# EAGLE design CDH-v3.7 (EAGLE 7.3.0)
sdf
DRAWING_AUTHOR: Lambert Le
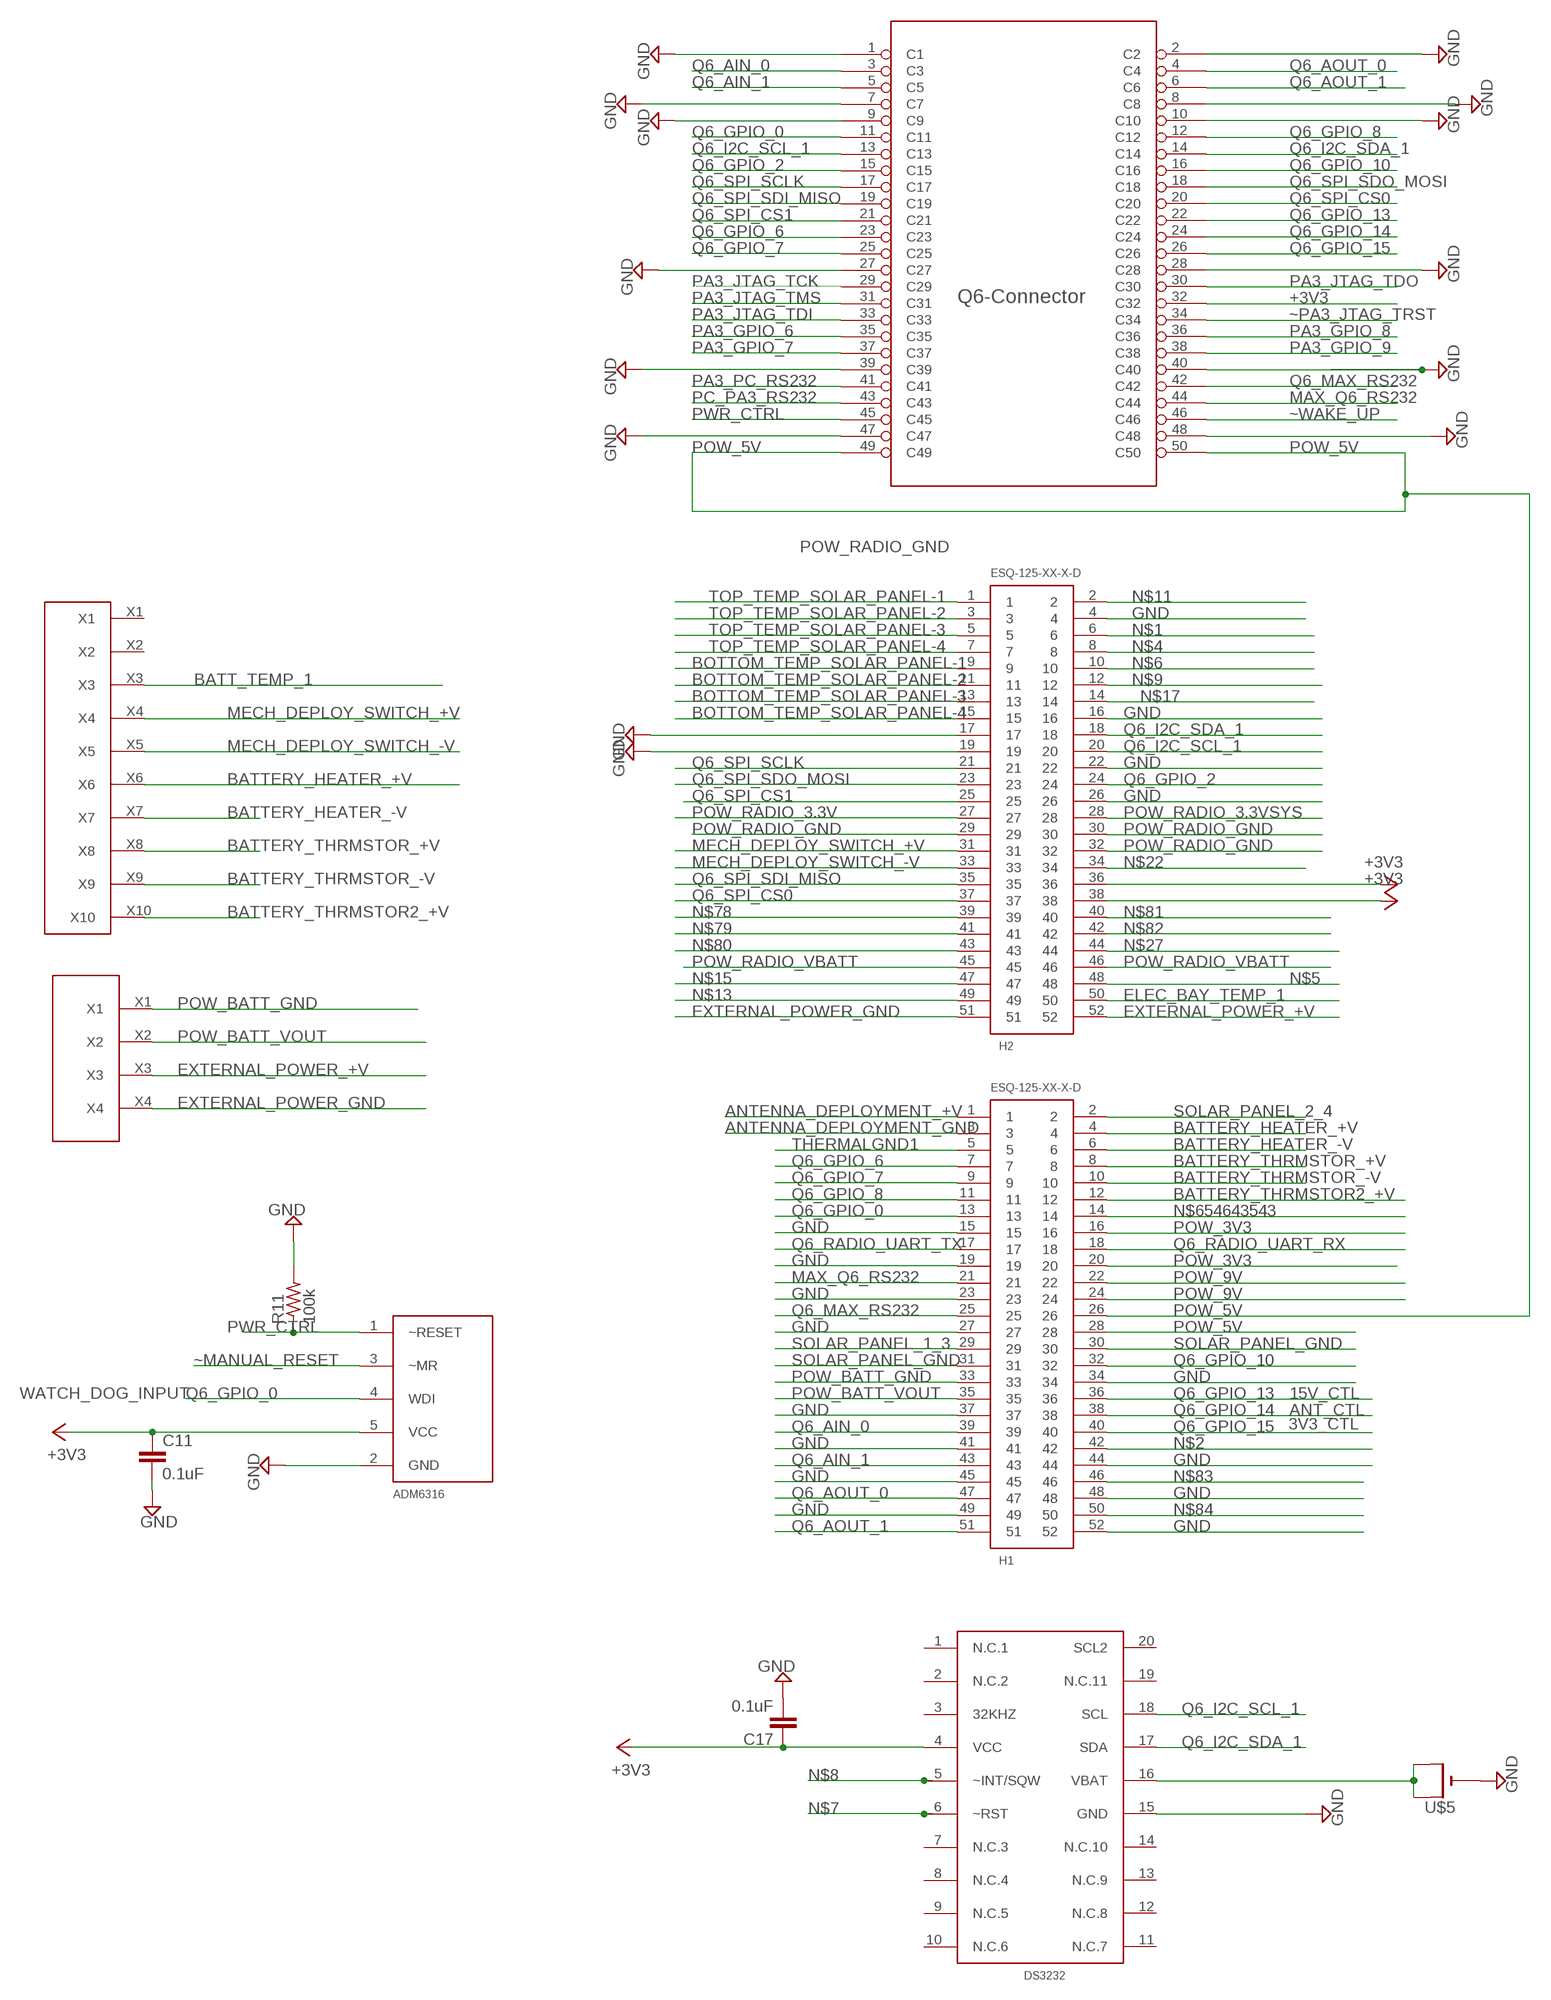
[diagram p0: schematic, sheet 1, part 1 of 2]
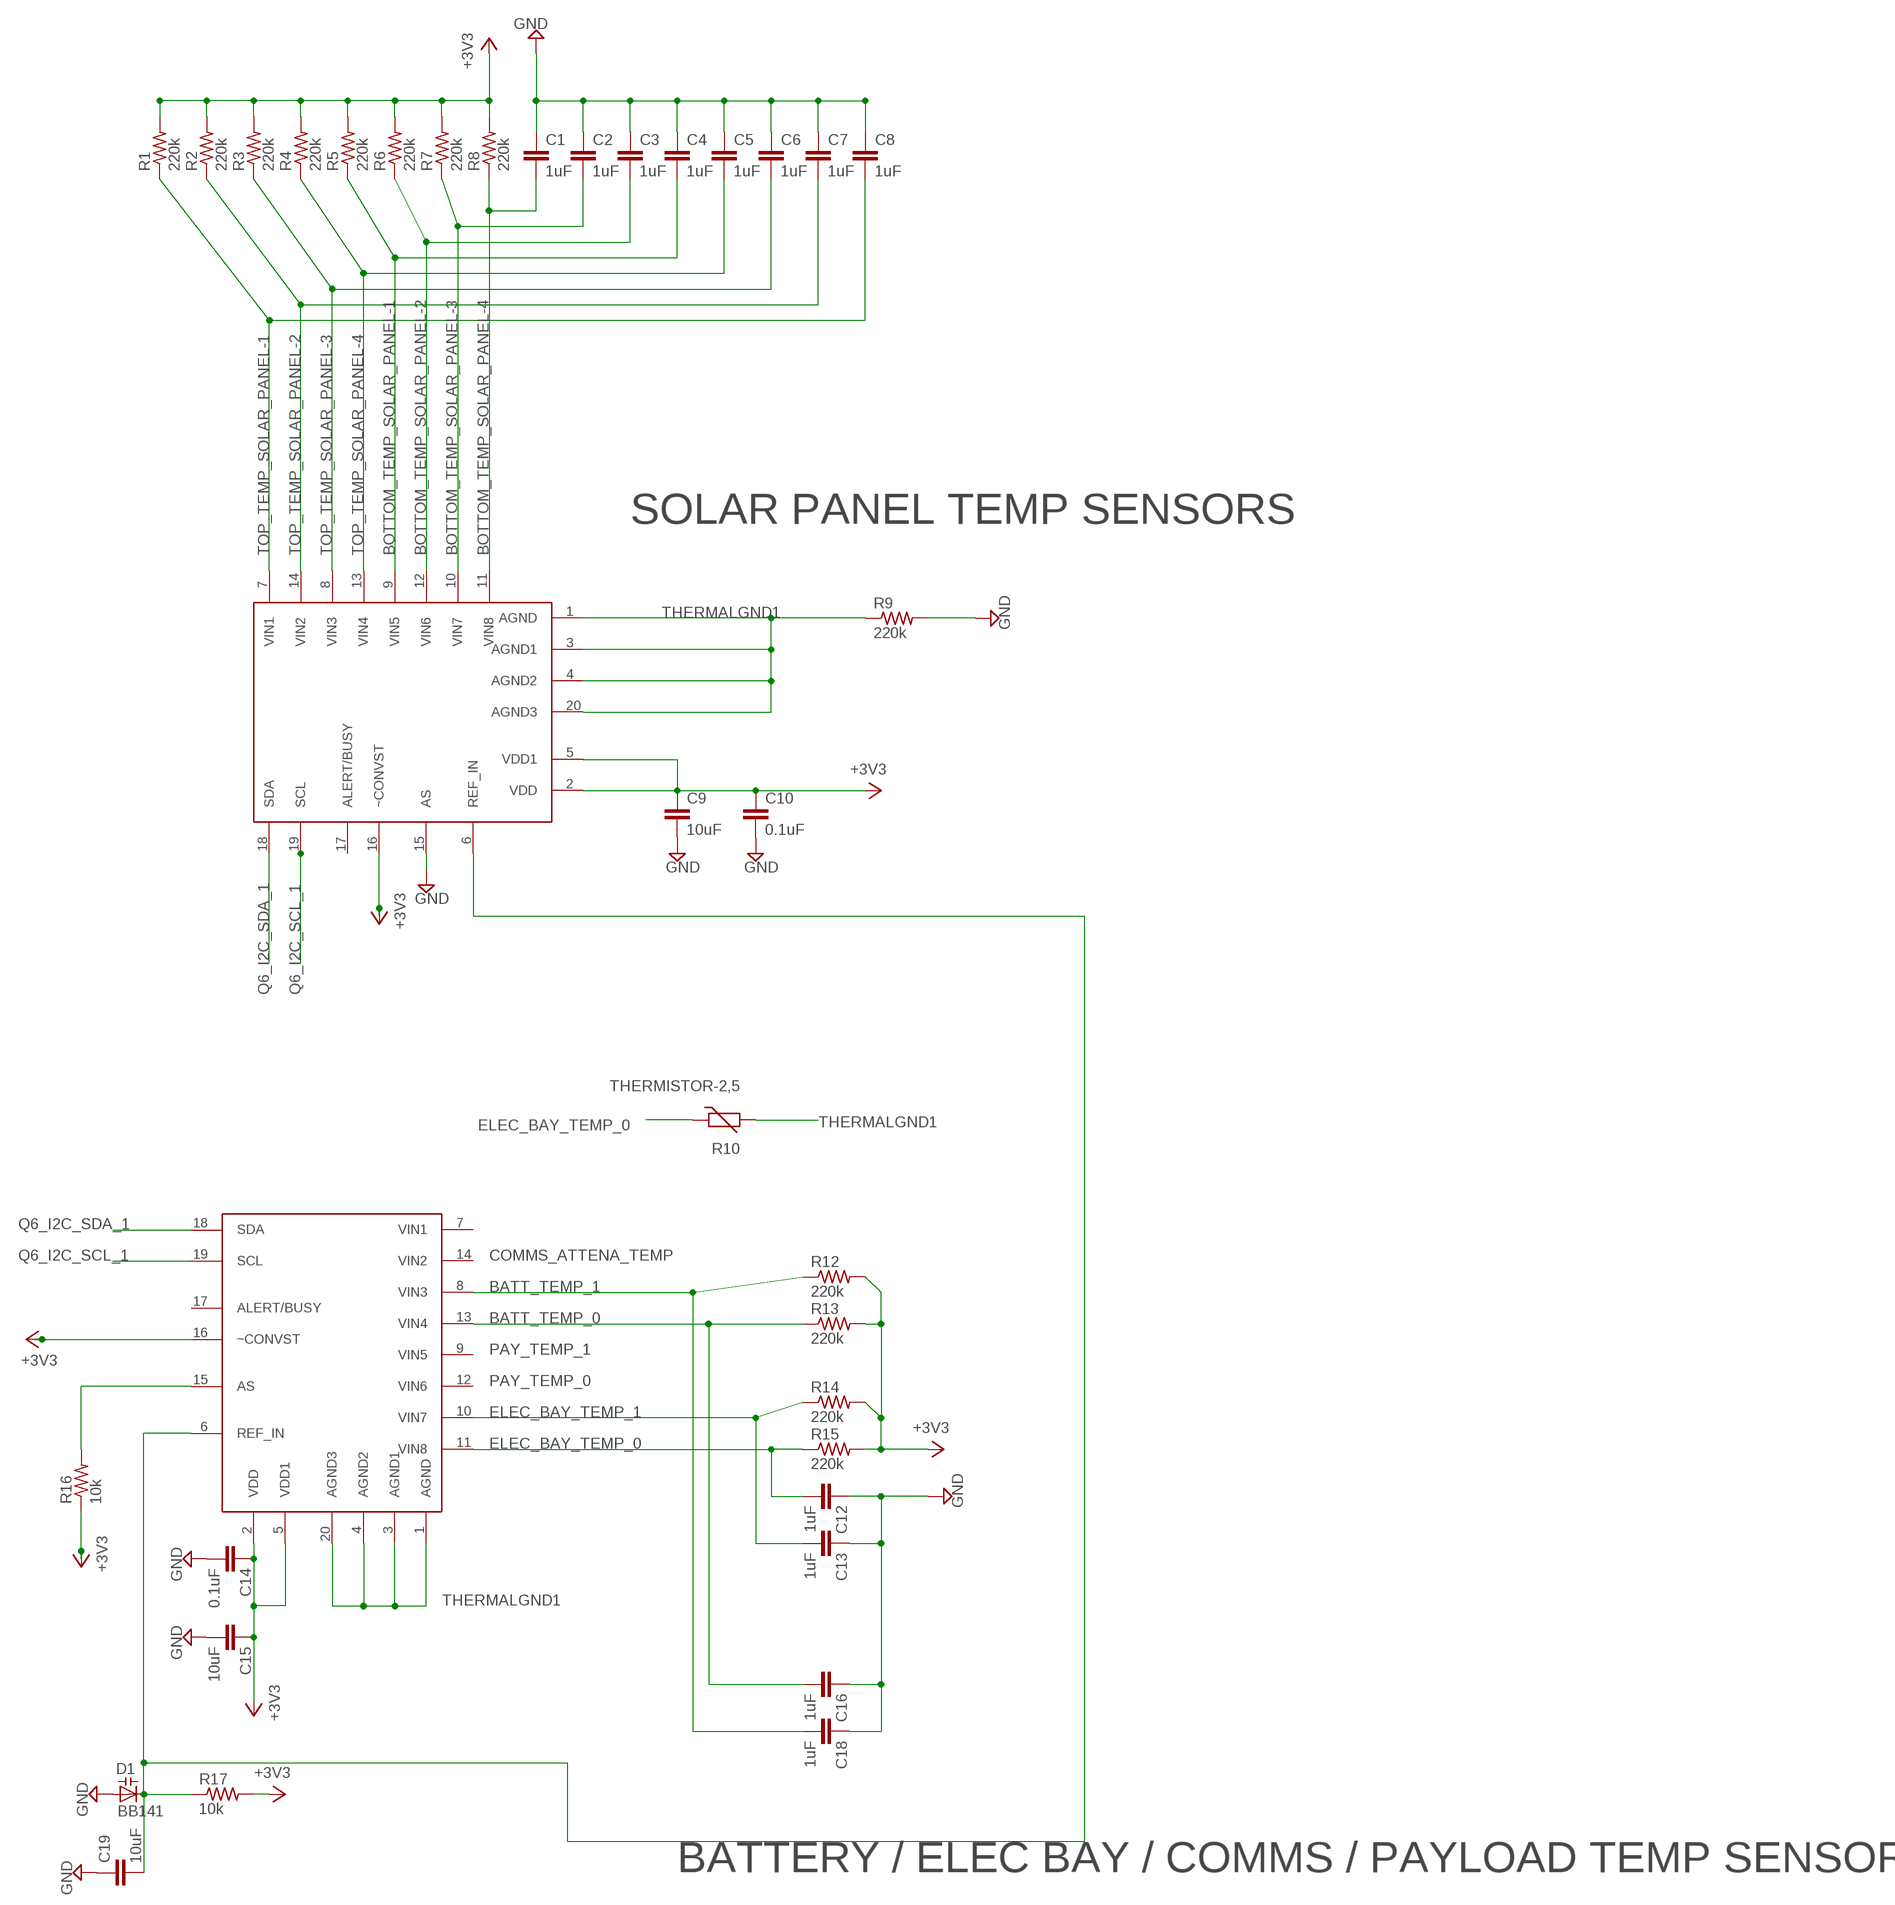
[diagram p1: schematic, sheet 1, part 2 of 2]

## Parts
ADC_TEMP_1  AD7998-1  [TSSOP20]
ADC_TEMP_2  AD7998-1  [TSSOP20]
C1  1uF  C-EUC2012  [C2012]
C2  1uF  C-EUC2012  [C2012]
C3  1uF  C-EUC2012  [C2012]
C4  1uF  C-EUC2012  [C2012]
C5  1uF  C-EUC2012  [C2012]
C6  1uF  C-EUC2012  [C2012]
C7  1uF  C-EUC2012  [C2012]
C8  1uF  C-EUC2012  [C2012]
C9  10uF  C-EUC2012  [C2012]
C10  0.1uF  C-EUC2012  [C2012]
C11  0.1uF  C-EUC2012  [C2012]
C12  1uF  C-EUC2012  [C2012]
C13  1uF  C-EUC2012  [C2012]
C14  0.1uF  C-EUC2012  [C2012]
C15  10uF  C-EUC2012  [C2012]
C16  1uF  C-EUC2012  [C2012]
C17  0.1uF  C-EUC2012  [C2012]
C18  1uF  C-EUC2012  [C2012]
C19  10uF  C-EUC2012  [C2012]
D1  BB141  [SOD523]
H1  ESQ-125-XX-X-D  [ESQ-125-XX-X-D]
H2  ESQ-125-XX-X-D  [ESQ-125-XX-X-D]
J2  M80-5000000M1-10-331-000  [M80-5000000M1]
J3  M80-5000000M1-10-331-00-000  [M80-5000000M1-04-331-00-000]
J4  SMFC  [SFMC-107-01-XX-D]
R1  220k  R-US_R2012  [R2012]
R2  220k  R-US_R2012  [R2012]
R3  220k  R-US_R2012  [R2012]
R4  220k  R-US_R2012  [R2012]
R5  220k  R-US_R2012  [R2012]
R6  220k  R-US_R2012  [R2012]
R7  220k  R-US_R2012  [R2012]
R8  220k  R-US_R2012  [R2012]
R9  220k  R-US_R2012  [R2012]
R10  THERMISTOR-2,5  [RS-2,5]
R11  100k  R-US_R2012  [R2012]
R12  220k  R-US_R2012  [R2012]
R13  220k  R-US_R2012  [R2012]
R14  220k  R-US_R2012  [R2012]
R15  220k  R-US_R2012  [R2012]
R16  10k  R-US_R2012  [R2012]
R17  10k  R-US_R2012  [R2012]
U$4  ADM6316/ADM6320  [SOT23-5]
U$5  CR1220SMT  [CR1220-SMD]
U$6  DS3232  [SO20L]

## Nets
+3V3: ADC_TEMP_1.2(VDD) ADC_TEMP_1.5(VDD1) ADC_TEMP_1.16(~CONVST) ADC_TEMP_2.2(VDD) ADC_TEMP_2.5(VDD1) ADC_TEMP_2.16(~CONVST) C9.1 C10.1 C11.1 C14.1 C15.1 C17.1 H2.36 H2.38 J4.32(C32) R1.2 R2.2 R3.2 R4.2 R5.2 R6.2 R7.2 R8.2 R12.2 R13.2 R14.2 R15.2 R16.1 R17.2 U$4.5(VCC) U$6.4(VCC)
ANTENNA_DEPLOYMENT_+V: H1.1
ANTENNA_DEPLOYMENT_GND: H1.3
BATT_TEMP_0: ADC_TEMP_2.13(VIN4) C16.2 R13.1
BATT_TEMP_1: ADC_TEMP_2.8(VIN3) C18.2 J2.X3 R12.1
BATTERY_HEATER_+V: H1.4 J2.X6
BATTERY_HEATER_-V: H1.6 J2.X7
BATTERY_THRMSTOR2_+V: H1.12 J2.X10
BATTERY_THRMSTOR_+V: H1.8 J2.X8
BATTERY_THRMSTOR_-V: H1.10 J2.X9
BOTTOM_TEMP_SOLAR_PANEL-1: ADC_TEMP_1.9(VIN5) C4.2 H2.9 R5.1
BOTTOM_TEMP_SOLAR_PANEL-2: ADC_TEMP_1.12(VIN6) C3.2 H2.11 R6.1
BOTTOM_TEMP_SOLAR_PANEL-3: ADC_TEMP_1.10(VIN7) C2.2 H2.13 R7.1
BOTTOM_TEMP_SOLAR_PANEL-4: ADC_TEMP_1.11(VIN8) C1.2 H2.15 R8.1
ELEC_BAY_TEMP_0: ADC_TEMP_2.11(VIN8) C12.2 R10.1 R15.1
ELEC_BAY_TEMP_1: ADC_TEMP_2.10(VIN7) C13.2 H2.50 R14.1
EXTERNAL_POWER_+V: H2.52 J3.X3
EXTERNAL_POWER_GND: H2.51 J3.X4
GND: ADC_TEMP_1.15(AS) C1.1 C2.1 C3.1 C4.1 C5.1 C6.1 C7.1 C8.1 C9.2 C10.2 C11.2 C12.1 C13.1 C14.2 C15.2 C16.1 C17.2 C18.1 C19.1 D1.A H1.15 H1.19 H1.23 H1.27 H1.34 H1.37 H1.41 H1.44 H1.45 H1.48 H1.49 H1.52 H2.4 H2.16 H2.17 H2.19 H2.22 H2.26 J4.1(C1) J4.2(C2) J4.7(C7) J4.8(C8) J4.9(C9) J4.10(C10) J4.27(C27) J4.28(C28) J4.39(C39) J4.40(C40) J4.47(C47) J4.48(C48) R9.2 R11.2 U$4.2(GND) U$5.- U$6.15(GND)
MAX_Q6_RS232: H1.21 J4.44(C44)
MECH_DEPLOY_SWITCH_+V: H2.31 J2.X4
MECH_DEPLOY_SWITCH_-V: H2.33 J2.X5
N$1: H2.6
N$2: H1.42
N$3: ADC_TEMP_2.15(AS) R16.2
N$4: H2.8
N$5: H2.48
N$6: H2.10
N$7: U$6.6(~RST)
N$8: U$6.5(~INT/SQW)
N$9: H2.12
N$11: H2.2
N$13: H2.49
N$15: H2.47
N$17: H2.14
N$22: H2.34
N$27: H2.44
N$78: H2.39
N$79: H2.41
N$80: H2.43
N$81: H2.40
N$82: H2.42
N$83: H1.46
N$84: H1.50
N$654643543: H1.14
PA3_GPIO_6: J4.35(C35)
PA3_GPIO_7: J4.37(C37)
PA3_GPIO_8: J4.36(C36)
PA3_GPIO_9: J4.38(C38)
PA3_JTAG_TCK: J4.29(C29)
PA3_JTAG_TDI: J4.33(C33)
PA3_JTAG_TDO: J4.30(C30)
PA3_JTAG_TMS: J4.31(C31)
PA3_PC_RS232: J4.41(C41)
PC_PA3_RS232: J4.43(C43)
POW_3V3: H1.16 H1.20
POW_5V: H1.26 H1.28 J4.49(C49) J4.50(C50)
POW_9V: H1.22 H1.24
POW_BATT_GND: H1.33 J3.X1
POW_BATT_VOUT: H1.35 J3.X2
POW_RADIO_3.3V: H2.27
POW_RADIO_3.3VSYS: H2.28
POW_RADIO_GND: H2.29 H2.30 H2.32
POW_RADIO_VBATT: H2.45 H2.46
PWR_CTRL: J4.45(C45) R11.1 U$4.1(~RESET)
Q6_AIN_0: H1.39 J4.3(C3)
Q6_AIN_1: H1.43 J4.5(C5)
Q6_AOUT_0: H1.47 J4.4(C4)
Q6_AOUT_1: H1.51 J4.6(C6)
Q6_GPIO_0: H1.13 J4.11(C11) U$4.4(WDI)
Q6_GPIO_2: H2.24 J4.15(C15)
Q6_GPIO_6: H1.7 J4.23(C23)
Q6_GPIO_7: H1.9 J4.25(C25)
Q6_GPIO_8: H1.11 J4.12(C12)
Q6_GPIO_10: H1.32 J4.16(C16)
Q6_GPIO_13: H1.36 J4.22(C22)
Q6_GPIO_14: H1.38 J4.24(C24)
Q6_GPIO_15: H1.40 J4.26(C26)
Q6_I2C_SCL_1: ADC_TEMP_1.19(SCL) ADC_TEMP_2.19(SCL) H2.20 J4.13(C13) U$6.18(SCL)
Q6_I2C_SDA_1: ADC_TEMP_1.18(SDA) ADC_TEMP_2.18(SDA) H2.18 J4.14(C14) U$6.17(SDA)
Q6_MAX_RS232: H1.25 J4.42(C42)
Q6_RADIO_UART_RX: H1.18
Q6_RADIO_UART_TX: H1.17
Q6_SPI_CS0: H2.37 J4.20(C20)
Q6_SPI_CS1: H2.25 J4.21(C21)
Q6_SPI_SCLK: H2.21 J4.17(C17)
Q6_SPI_SDI_MISO: H2.35 J4.19(C19)
Q6_SPI_SDO_MOSI: H2.23 J4.18(C18)
REF_IN: ADC_TEMP_1.6(REF_IN) ADC_TEMP_2.6(REF_IN) C19.2 D1.C R17.1
SOLAR_PANEL_1_3: H1.29
SOLAR_PANEL_2_4: H1.2
SOLAR_PANEL_GND: H1.30 H1.31
THERMALGND1: ADC_TEMP_1.1(AGND) ADC_TEMP_1.3(AGND1) ADC_TEMP_1.4(AGND2) ADC_TEMP_1.20(AGND3) ADC_TEMP_2.1(AGND) ADC_TEMP_2.3(AGND1) ADC_TEMP_2.4(AGND2) ADC_TEMP_2.20(AGND3) H1.5 R9.1 R10.2
TOP_TEMP_SOLAR_PANEL-1: ADC_TEMP_1.7(VIN1) C8.2 H2.1 R1.1
TOP_TEMP_SOLAR_PANEL-2: ADC_TEMP_1.14(VIN2) C7.2 H2.3 R2.1
TOP_TEMP_SOLAR_PANEL-3: ADC_TEMP_1.8(VIN3) C6.2 H2.5 R3.1
TOP_TEMP_SOLAR_PANEL-4: ADC_TEMP_1.13(VIN4) C5.2 H2.7 R4.1
VBAT: U$5.+$1(+) U$5.+$2(+1) U$6.16(VBAT)
~MANUAL_RESET: U$4.3(~MR)
~PA3_JTAG_TRST: J4.34(C34)
~WAKE_UP: J4.46(C46)
Unconnected: ADC_TEMP_1.17(ALERT/BUSY) ADC_TEMP_2.7(VIN1) ADC_TEMP_2.9(VIN5) ADC_TEMP_2.12(VIN6) ADC_TEMP_2.14(VIN2) ADC_TEMP_2.17(ALERT/BUSY) J2.X1 J2.X2 U$6.1(N.C.1) U$6.2(N.C.2) U$6.3(32KHZ) U$6.7(N.C.3) U$6.8(N.C.4) U$6.9(N.C.5) U$6.10(N.C.6) U$6.11(N.C.7) U$6.12(N.C.8) U$6.13(N.C.9) U$6.14(N.C.10) U$6.19(N.C.11) U$6.20(SCL2)

## Notes on the sheet
- Q6_AOUT_0
- Q6_AOUT_1
- Q6-Connector
- SOLAR PANEL TEMP SENSORS
- POW_RADIO_GND
- SOLAR_PANEL_2_4
- COMMS_ATTENA_TEMP
- BATT_TEMP_1
- BATT_TEMP_0
- PAY_TEMP_1
- WATCH_DOG_INPUT | 15V_CTL | PAY_TEMP_0
- ANT_CTL
- 3V3_CTL | ELEC_BAY_TEMP_1
- ELEC_BAY_TEMP_0
- BATTERY / ELEC BAY / COMMS / PAYLOAD TEMP SENSORS

## Library data of the parts
ADC_TEMP_1 ADC_TEMP_2 = analog-devices:AD7998-1
C1-C19 = rcl:C-EU: CAPACITOR, European symbol
D1 = diode:BB141: Capacity DIODE variable-capacitance diode
H1 H2 = ESQ-126-XX-X-D:ESQ-125-XX-X-D: ELEVATED SOCKET, .100 inch(2.54mm) PITCH
J2 = harwin:M80-5000000M1-10-331-000
J3 = harwin:M80-5000000M1-10-331-00-000
J4 = SFMC-125-02-S-D:SMFC
R1-R9 R11-R17 = resistor:R-US_: RESISTOR, American symbol
R10 = varistor:THERMISTOR: THERMISTOR
U$4 = analog-devices:ADM6316/ADM6320
U$5 = adafruit:CR1220: CR1216/CR1220/CR1225 12mm 3V lithium coin cell Great for battery packup. Both SMT and THM holders. Note the THM package has the ground pads on both sides of the PCB so that the masks are the same - this reduces the cost
U$6 = maxim:DS3232

## Net classes
0 default: width 0.406 mm

## Board
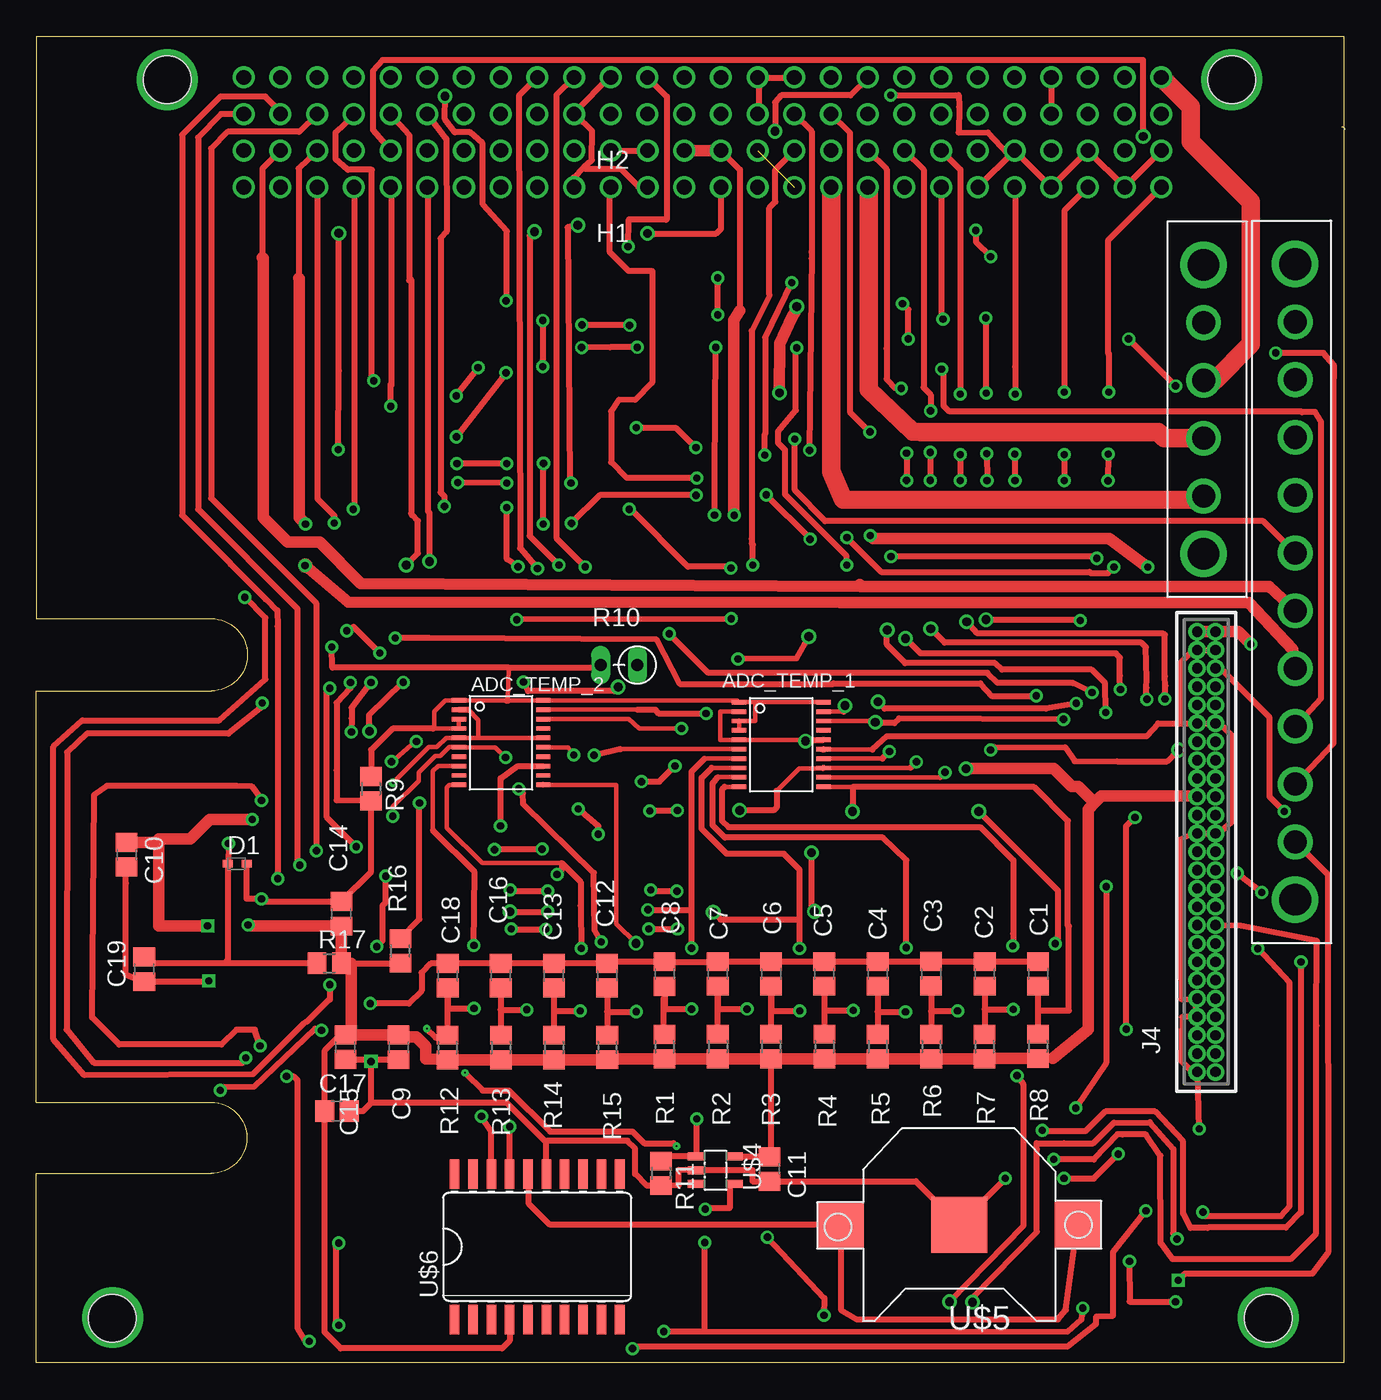
[diagram p2: board, top side]
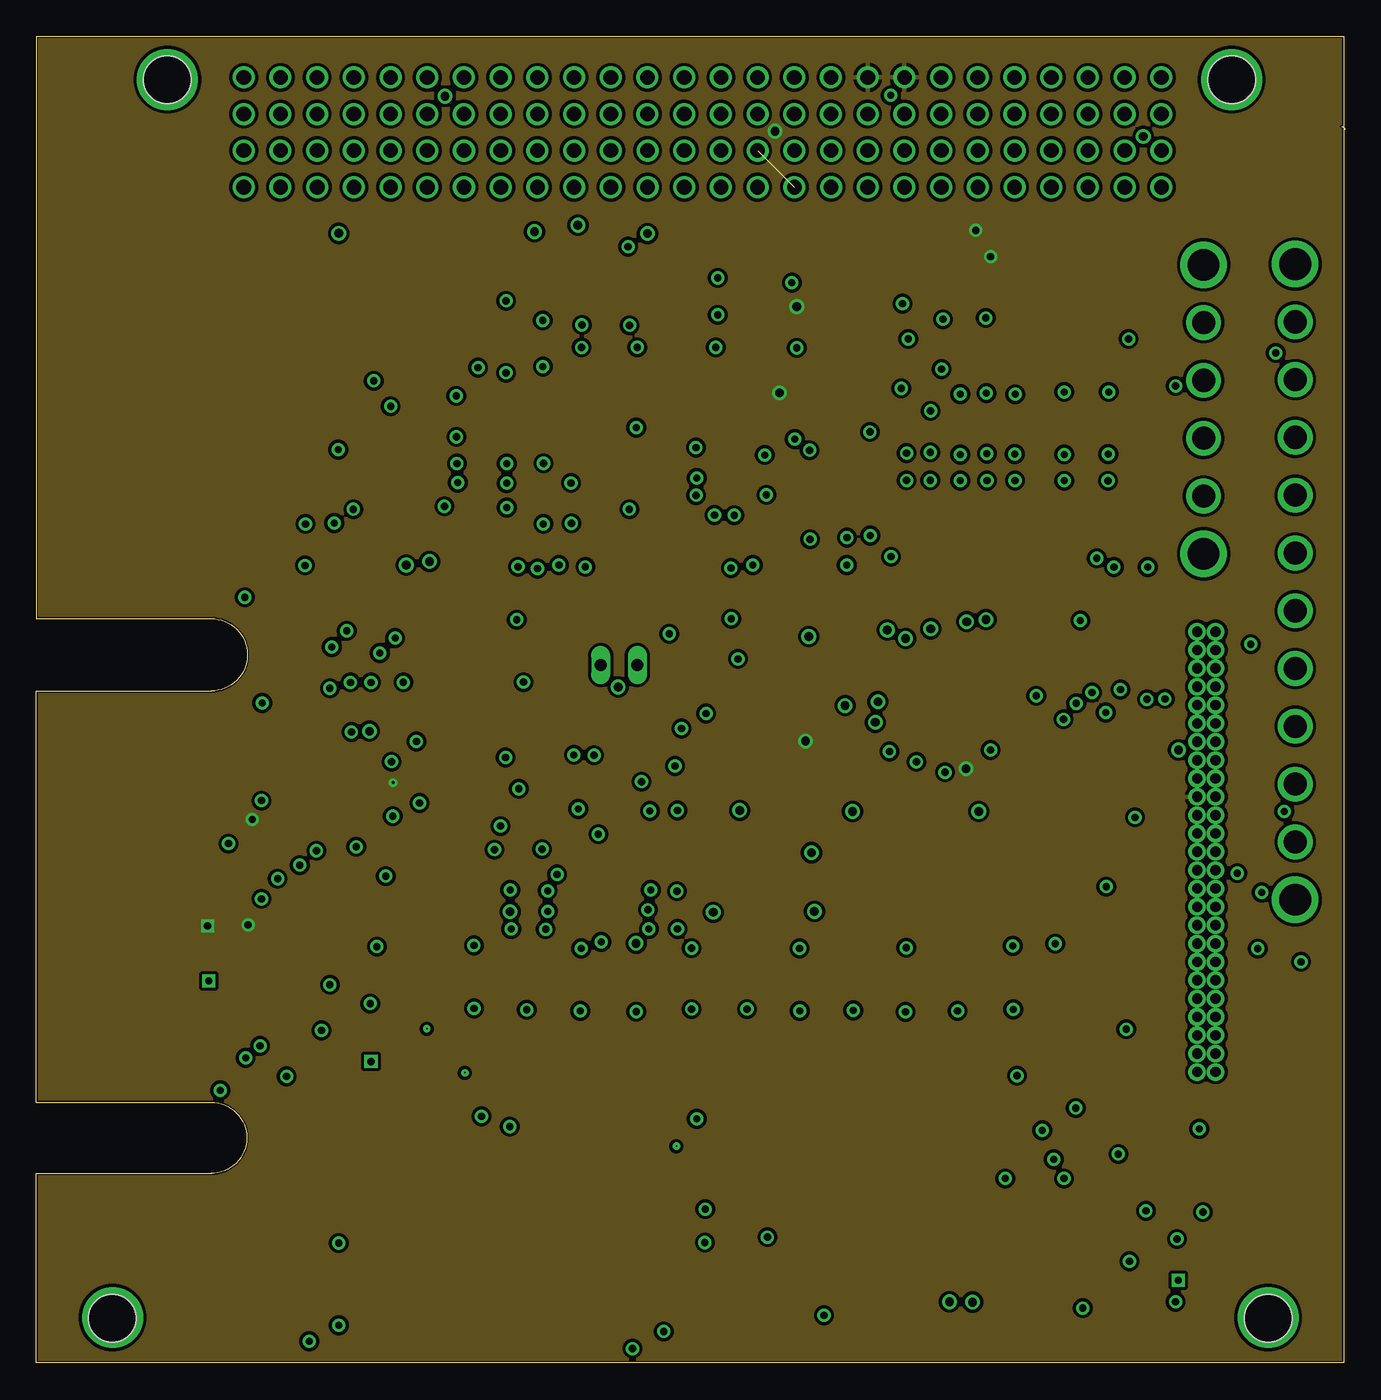
[diagram p3: board, inner layer +3V3]
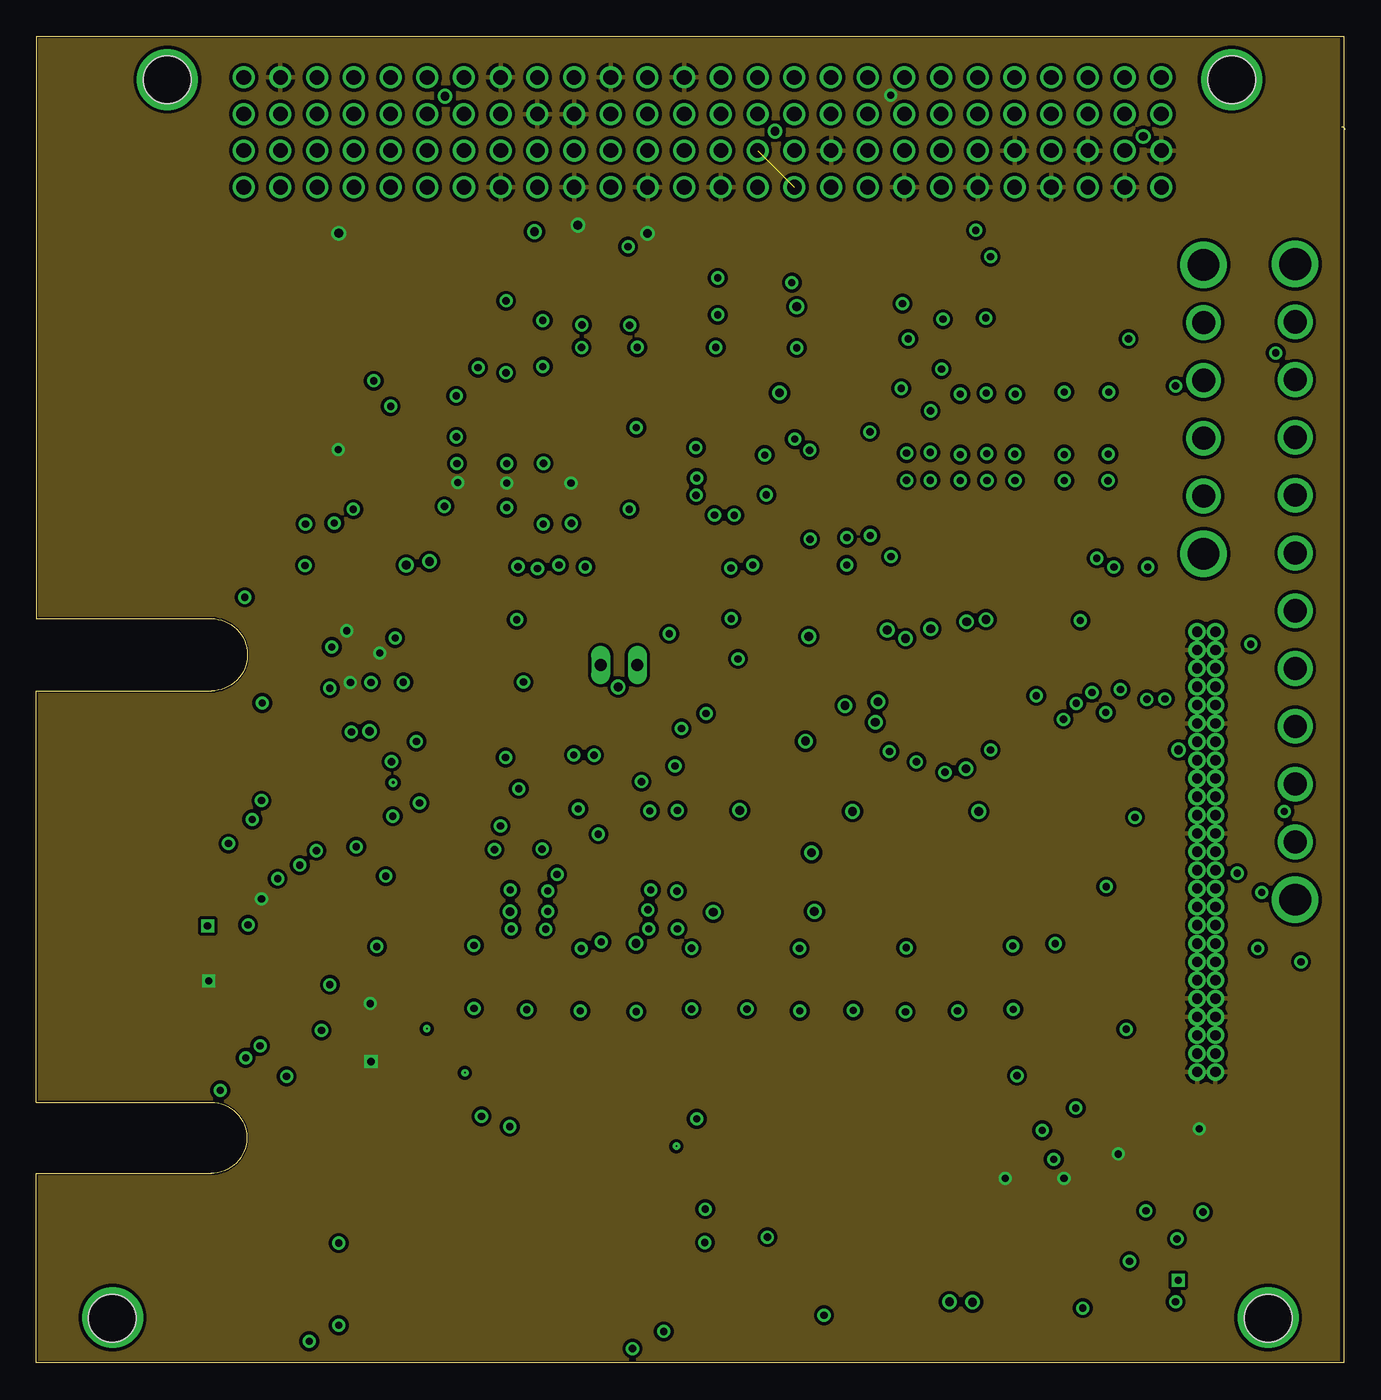
[diagram p4: board, inner layer GND]
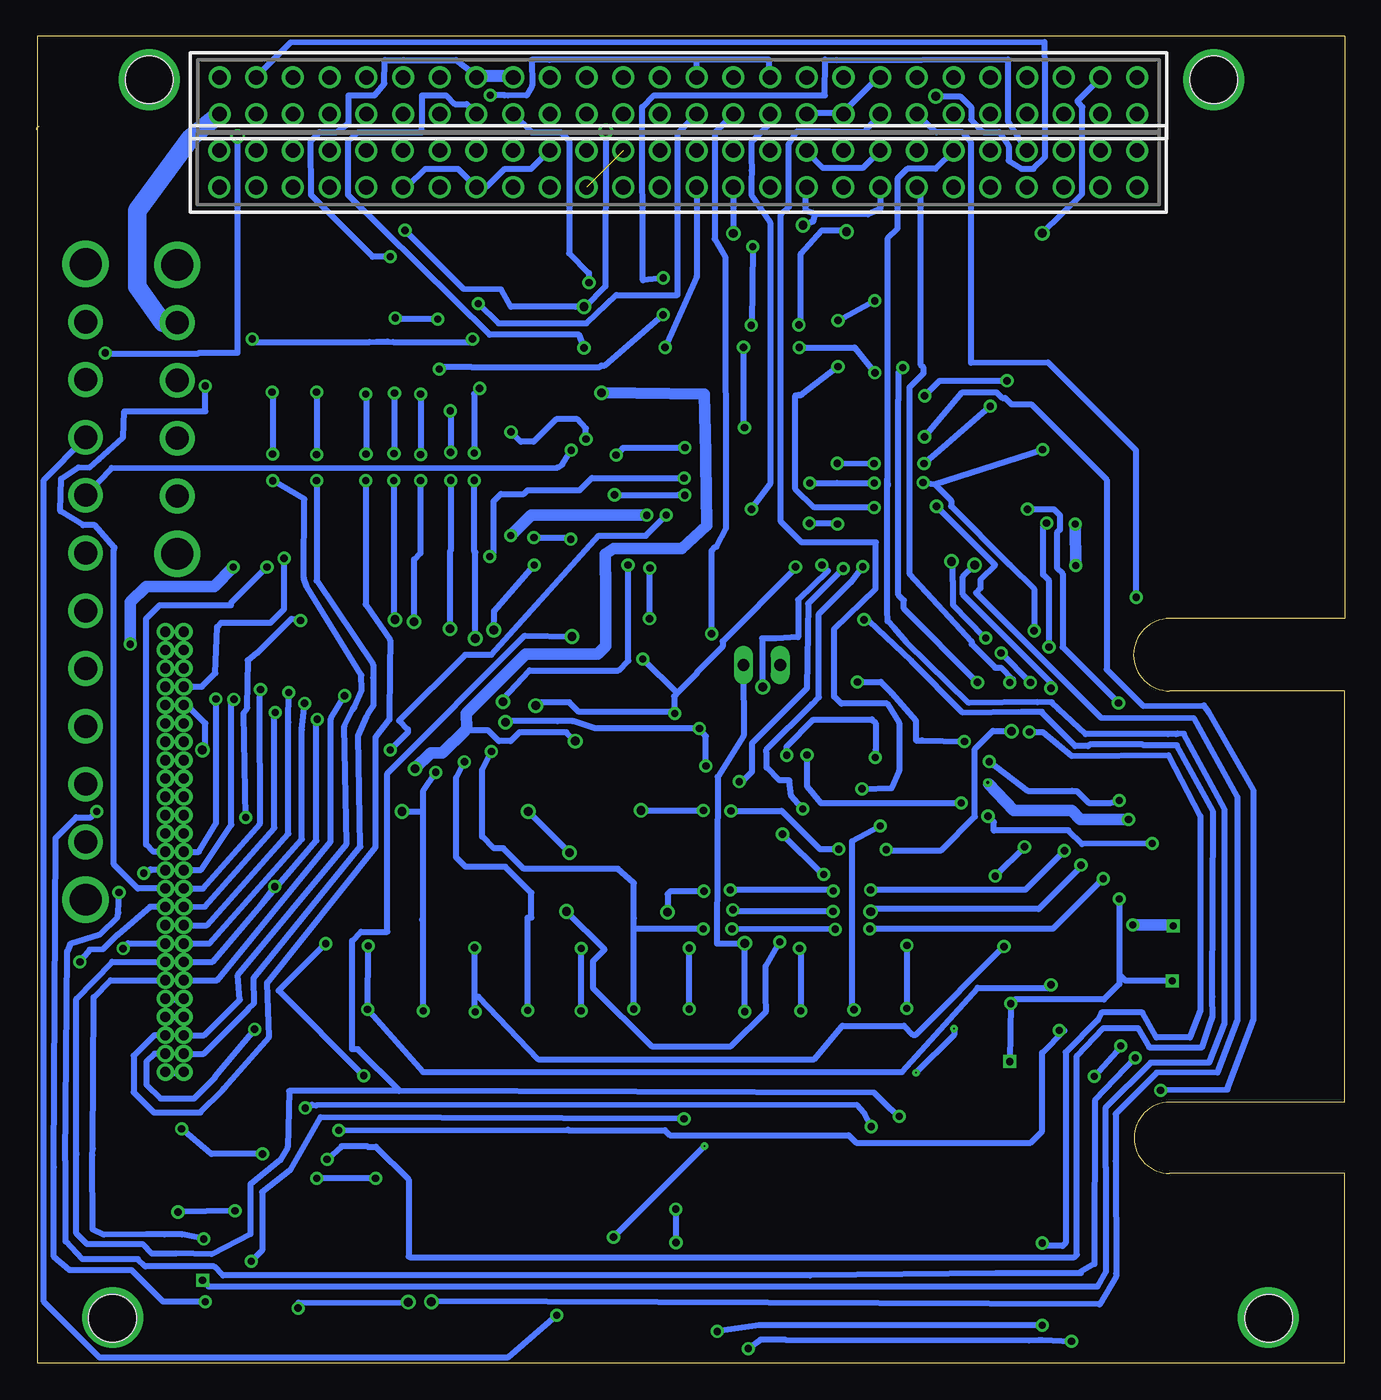
[diagram p5: board, bottom side, seen from below]

Size 90.56 x 91.83 mm. Coordinates in mm from the lower left corner, seen from the top.
Outline: 0.01,51.5 12.13,51.5
Outline: 12.14,46.5 0.01,46.5 0,18.03 12.13,18.03
Outline: 12.14,13.09 0.01,13.09 0.01,0 90.48,0 90.48,91.83 0.01,91.83 0.01,51.5
Outline: 12.12,51.5 arc-180 12.11,46.49
Outline: 12.11,18.03 arc-180 12.09,13.09
Outline: 90.34,85.56 arc-90 90.56,85.35
Copper layers (1*2+15*16): Top 0.035mm / dielectric 0.5mm / +3V3 0.035mm / dielectric 0.5mm / GND 0.035mm / dielectric 0.5mm / Bottom 0.035mm
Design rules "default": minimum track width 4mil, minimum drill 4mil, track to track 9mil, track to pad 9mil, pad to pad 9mil, via to via 9mil, smd to smd 9mil, copper to edge 5mil, drill to drill 5mil, minimum pad ring 10mil, minimum via ring 8mil, stop-mask expansion 4mil, vias tented up to drill 0mil, thermal gap 10mil
Holes 3.3 mm at 5.27,3.07 9.08,88.79 85.28,3.07 82.74,88.79

### Footprints (pad centres in the part's own frame; a part is rotated, then mirrored left to right if it is on the bottom)
TSSOP20 = smd 0.305 x 0.991: 1 -3.575,-2.918; 2 -2.925,-2.918; 3 -2.275,-2.918; 4 -1.625,-2.918; 5 -0.975,-2.918; 6 -0.325,-2.918; 7 0.325,-2.918; 8 0.975,-2.918; 9 1.625,-2.918; 10 2.275,-2.918; 11 2.275,2.918; 12 1.625,2.918; 13 0.975,2.918; 14 0.325,2.918; 15 -0.325,2.918; 16 -0.975,2.918; 17 -1.625,2.918; 18 -2.275,2.918; 19 -2.925,2.918; 20 -3.575,2.918
C2012 = smd 1.3 x 1.5: 1 -0.85,0; 2 0.85,0
SOD523 = smd 0.7 x 0.5: A 0.7,0; C -0.6,0
ESQ-125-XX-X-D = drill 1.016 pad 1.524: 1 -27.94,-1.27; 2 -27.94,1.27; 3 -25.4,-1.27; 4 -25.4,1.27; 5 -22.86,-1.27; 6 -22.86,1.27; 7 -20.32,-1.27; 8 -20.32,1.27; 9 -17.78,-1.27; 10 -17.78,1.27; 11 -15.24,-1.27; 12 -15.24,1.27; 13 -12.7,-1.27; 14 -12.7,1.27; 15 -10.16,-1.27; 16 -10.16,1.27; 17 -7.62,-1.27; 18 -7.62,1.27; 19 -5.08,-1.27; 20 -5.08,1.27; 21 -2.54,-1.27; 22 -2.54,1.27; 23 0,-1.27; 24 0,1.27; 25 2.54,-1.27; 26 2.54,1.27; 27 5.08,-1.27; 28 5.08,1.27; 29 7.62,-1.27; 30 7.62,1.27; 31 10.16,-1.27; 32 10.16,1.27; 33 12.7,-1.27; 34 12.7,1.27; 35 15.24,-1.27; 36 15.24,1.27; 37 17.78,-1.27; 38 17.78,1.27; 39 20.32,-1.27; 40 20.32,1.27; 41 22.86,-1.27; 42 22.86,1.27; 43 25.4,-1.27; 44 25.4,1.27; 45 27.94,-1.27; 46 27.94,1.27; 47 30.48,-1.27; 48 30.48,1.27; 49 33.02,-1.27; 50 33.02,1.27; 51 35.56,-1.27; 52 35.56,1.27
M80-5000000M1 = drill 2.2: P$11 -22,0; P$12 22,0 | drill 1.6: X1 -18,0; X2 -14,0; X3 -10,0; X4 -6,0; X5 -2,0; X6 2,0; X7 6,0; X8 10,0; X9 14,0; X10 18,0
M80-5000000M1-04-331-00-000 = drill 2.2: P$11 -10,0; P$12 10,0 | drill 1.6: X1 -6,0; X2 -2,0; X3 2,0; X4 6,0
SFMC-107-01-XX-D = drill 0.711 pad 1.067: 1 -15.875,-0.635; 2 -15.875,0.635; 3 -14.605,-0.635; 4 -14.605,0.635; 5 -13.335,-0.635; 6 -13.335,0.635; 7 -12.065,-0.635; 8 -12.065,0.635; 9 -10.795,-0.635; 10 -10.795,0.635; 11 -9.525,-0.635; 12 -9.525,0.635; 13 -8.255,-0.635; 14 -8.255,0.635; 15 -6.985,-0.635; 16 -6.985,0.635; 17 -5.715,-0.635; 18 -5.715,0.635; 19 -4.445,-0.635; 20 -4.445,0.635; 21 -3.175,-0.635; 22 -3.175,0.635; 23 -1.905,-0.635; 24 -1.905,0.635; 25 -0.635,-0.635; 26 -0.635,0.635; 27 0.635,-0.635; 28 0.635,0.635; 29 1.905,-0.635; 30 1.905,0.635; 31 3.175,-0.635; 32 3.175,0.635; 33 4.445,-0.635; 34 4.445,0.635; 35 5.715,-0.635; 36 5.715,0.635; 37 6.985,-0.635; 38 6.985,0.635; 39 8.255,-0.635; 40 8.255,0.635; 41 9.525,-0.635; 42 9.525,0.635; 43 10.795,-0.635; 44 10.795,0.635; 45 12.065,-0.635; 46 12.065,0.635; 47 13.335,-0.635; 48 13.335,0.635; 49 14.605,-0.635; 50 14.605,0.635
R2012 = smd 1.3 x 1.5: 1 -0.85,0; 2 0.85,0
RS-2,5 = drill 0.813 long: 1 -1.27,0; 2 1.27,0
SOT23-5 = smd 0.55 x 1.2: 1 -0.95,-1.3; 2 0,-1.3; 3 0.95,-1.3; 4 0.95,1.3; 5 -0.95,1.3
CR1220-SMD = smd 3.2 x 3.2: +$1 -8.2,0; +$2 8.2,0 | smd 3.9 x 3.9: - 0,0
SO20L = smd 0.66 x 2.032: 1 -5.715,-5.029; 2 -4.445,-5.029; 3 -3.175,-5.029; 4 -1.905,-5.029; 5 -0.635,-5.029; 6 0.635,-5.029; 7 1.905,-5.029; 8 3.175,-5.029; 9 4.445,-5.029; 10 5.715,-5.029; 11 5.715,5.029; 12 4.445,5.029; 13 3.175,5.029; 14 1.905,5.029; 15 0.635,5.029; 16 -0.635,5.029; 17 -1.905,5.029; 18 -3.175,5.029; 19 -4.445,5.029; 20 -5.715,5.029

### Placement (x,y rotation side)
ADC_TEMP_1  51.57,42.14 270 top
ADC_TEMP_2  32.17,42.27 270 top
C1  69.34,26.9 270 top
C2  65.65,26.91 270 top
C3  61.93,26.92 270 top
C4  58.24,26.91 270 top
C5  54.55,26.91 270 top
C6  50.86,26.9 270 top
C7  47.17,26.91 270 top
C8  43.49,26.9 270 top
C9  25.08,21.83 270 top
C10  6.26,35.16 270 top
C11  50.75,13.4 270 top
C12  39.51,26.79 270 top
C13  35.83,26.78 270 top
C14  21.12,31.07 90 top
C15  21.4,21.83 270 top
C16  32.15,26.79 270 top
C17  20.82,17.41 0 top
C18  28.48,26.78 270 top
C19  7.48,27.22 90 top
D1  13.86,34.53 0 top
H1  42.31,82.64 0 top
H2  42.3,87.7 0 top
J2  87.13,54.05 270 top
J3  80.79,65.99 90 top
J4  80.98,35.99 90 top
R1  43.48,21.88 270 top
R2  47.17,21.88 270 top
R3  50.85,21.88 270 top
R4  54.55,21.88 270 top
R5  58.24,21.88 270 top
R6  61.94,21.87 270 top
R7  65.63,21.87 270 top
R8  69.33,21.89 270 top
R9  23.17,39.72 270 top
R10  40.34,48.29 180 top
R11  43.24,13.1 270 top
R12  28.47,21.81 270 top
R13  32.16,21.81 270 top
R14  35.84,21.81 270 top
R15  39.52,21.82 270 top
R16  25.21,28.5 90 top
R17  20.28,27.64 0 top
U$4  47.01,13.32 270 top
U$5  63.88,9.54 180 top
U$6  34.67,8.02 0 top

### Tracks (layer width: path | path; a pad name or v marks a point on that pad's centre or on a via)
+3V3  (via drill 0.2, 0.5, 0.6, 0.61)
  Top 0.305: 30.61,43.24 ADC_TEMP_2.5 28.38,43.24 27.74,42.6 27.15,42.6 v24.7,40.15 | 30.61,43.24 ADC_TEMP_2.16 | 29.9,45.19 30.61,44.49 30.61,43.24 | 53.25,43.11 ADC_TEMP_1.5 47.33,43.11 47.33,45.06 ADC_TEMP_1.2
  Top 0.406: 65.63,21.04 R7.2 | R6.2 | R5.2 | R4.2 | R3.2 50.85,14.25 C11.1 50.74,14.27 U$4.5 | R2.2 47.17,20.92 46.61,20.92 46.61,21.03 | 39.52,21.03 R15.2 | R14.2 | R13.2 | R12.2 | C15.1 21.04,22.68 19.98,21.62 C17.1 19.96,17.4 19.96,2.11 21.08,0.99 32.25,0.99 32.77,1.51 U$6.4 | 21.55,27.52 R17.2 21.81,27.64 R16.1 | ADC_TEMP_2.2 29.9,45.19 | ADC_TEMP_1.16 53.25,43.11 v53.25,43.02 | R8.2 70.37,21.04 | 80.29,39.22 J4.32 | 8.25,36.01 8.49,36.25 | C14.1 21.13,30.21 | 14.67,30.22 v14.67,30.29 | v66.05,76.55 65.03,77.57 v65.03,78.38 | 52.72,73.07 v52.64,73.1 | H2.36 57.54,88.93 56.35,87.73 51.57,87.73 51.13,87.25 v51.13,85.24 v51.14,85.24 | v14.96,37.6 15.04,37.74 14.9,37.6 | 73.3,38.81 73.36,38.75 73.06,38.96
  Top 0.813: R8.2 65.63,21.04 | R7.2 R6.2 | R6.2 R5.2 | R5.2 R4.2 | R4.2 R3.2 | R3.2 R2.2 | 46.61,21.03 R1.2 39.52,21.03 | R15.2 R14.2 | R14.2 R13.2 | R13.2 R12.2 26.97,21.02 26.97,21.9 26.31,22.56 25.19,22.56 C9.1 C15.1 | 70.37,21.04 72.79,23.06 72.79,38.3 73.3,38.81 73.71,39.22 80.29,39.22 | C10.1 8.25,36.01 | 21.13,30.21 R17.2 | C14.1 14.67,30.22 | v11.86,30.23 8.49,30.23 8.49,36.25 10.67,36.25 12.02,37.6 14.9,37.6 14.95,37.65 | 52.72,73.07 52.29,72.34 51.45,70.53 v51.44,67.13 | C15.1 21.81,23.09 21.81,27.64 | v64.34,41.12 70.42,41.12 71.65,39.89 72.13,39.89 73.06,38.96
  Bottom 0.406: 11.86,30.29 v11.86,30.23 | 59.95,88.95 H2.38 60.15,89.15 61.49,90.17 65.15,90.17 66.43,90.17 66.45,88.54 67.13,87.73 68.25,87.73 68.94,87.73 68.94,85.8 69.74,85.19 70.94,85.18 71.56,84.54 71.53,80.82 67.27,76.55 v66.05,76.55 | v65.03,78.38 60.97,74.31 58.38,74.29 57.71,73.09 53.24,73.09 v52.64,73.1 52.57,73.1 51.16,74.51 v51.14,85.24 | v53.25,43.02 53.86,43.63 57.11,43.63 57.72,43.02 58.53,43.02 59.28,43.77 60.88,43.77 60.76,43.89
  Bottom 0.813: v14.67,30.29 11.86,30.29 | 60.88,43.77 62.44,42.21 63.25,42.21 v64.34,41.12 | 60.76,43.89 60.79,44.94 56.67,49.06 51.68,49.06 51.15,49.59 51.15,54.62 51.16,54.63 51.16,55.97 50.58,56.35 45.86,56.35 44.14,57.96 44.23,62.42 44.23,62.93 44.31,67.06 v51.44,67.13 | v14.96,37.6 18.29,37.6 18.9,38.21 22.91,38.21 24.65,40.04
  pour +3V3: 0.32,92.18 90.5,91.92 90.5,-0.37 0.09,-0.37 -0.19,91.84 0.05,92.03 0.21,92.2
BATT_TEMP_0  (via drill 0.5)
  Top 0.406: R13.1 32.16,25.94 C16.2 32.15,24.43 v33.96,24.43 | v32.14,37.14 32.14,40.44 33.34,41.29 ADC_TEMP_2.13
  Bottom 0.406: v32.14,37.14 34.09,36.1 34.09,24.56 v33.96,24.43
BATT_TEMP_1  (via drill 0.1, 0.5)
  Top 0.305: 27.46,36.84 27.46,40.94 27.82,41.31 29.24,41.31 29.24,41.29 ADC_TEMP_2.8
  Top 0.406: v30.3,24.51 28.48,24.51 C18.2 28.48,22.66 R12.1 28.46,22.5 27.64,22.5 v27.03,23.11 | v30.3,28.88 30.34,33.96 27.46,36.84 | v54.52,3.27 54.55,4.46 v50.6,8.68 | v44.31,14.98 44.1,15.18 42.07,15.18 41.26,16 35.57,16 32.72,18.84 30.89,18.84 v29.67,20.06
  Bottom 0.406: v30.3,28.88 v30.3,28.87 v30.3,24.51 | v54.52,3.27 57.92,0.35 86.16,0.35 90.03,4.21 90.03,61.11 87.18,63.95 J2.X3 | v44.31,14.98 v50.6,8.68 | v29.67,20.06 27.03,22.7 v27.03,23.11
BATTERY_HEATER_+V
  Top 0.406: H1.4 15.66,82.65 15.66,76.49
  Top 0.813: J2.X6 85.32,53.72 57.29,53.72 | 57.29,53.72 57.01,53.84 | 15.66,76.49 15.71,76.44 15.71,58.48 17.41,56.78 19.62,56.78 22.48,53.92 57.08,53.71 57.29,53.72
BATTERY_HEATER_-V  (via drill 0.5)
  Top 0.406: H1.6 18.16,82.68 18.18,75.07
  Top 0.813: J2.X7 86.97,49.38 83.91,52.6 56.81,52.63 55.64,52.6 21.61,52.64 18.63,55.18 | 18.18,75.07 18.21,75.04 18.21,58.49 v18.64,58.05
  Top 1.016: v18.61,55.18 18.63,55.18
  Bottom 0.813: v18.61,55.18 18.64,57.97 v18.64,58.05
BATTERY_THRMSTOR2_+V  (via drill 0.5)
  Top 0.406: J2.X10 89.38,33.79 89.41,7.63 88.32,6.16 79.5,6.16 v79.04,5.69 79.04,5.89
  Bottom 0.406: H1.12 28.33,82.64 30.26,82.64 30.96,81.94 30.95,81.93 30.95,78.5 31.61,77.84 31.61,60.72 31.66,61.13 31.66,52.07 31.63,51.32 31.17,50.84 30.32,49.85 26.01,45.67 21.27,45.73 20.26,45.71 19.8,45.24 17.92,43.5 12.21,43.51 11.69,43.51 11.55,43.55 11.14,43.53 8.3,38.28 8.3,23.49 9.38,20.76 13.43,20.76 16.57,17.62 16.57,13.54 16.51,13.48 16.51,6.31 17.09,5.28 78.62,5.28 v79.04,5.69
BATTERY_THRMSTOR_+V  (via drill 0.5)
  Top 0.406: J2.X8 88.92,45.99 88.92,65.13 88.5,65.81 87.65,65.81 87.61,65.77 87.54,65.84 63.2,65.84 62.81,66.23 62.81,68.65 62.68,68.78 v62.66,68.78 | v47.16,75.08 47.17,74.62 v47.17,72.53
  Bottom 0.406: v62.66,68.78 62.51,68.93 60.45,68.93 60.45,68.92 51.55,68.92 51.42,69.03 51.21,69.03 v47.17,72.53 | v47.16,75.08 48.57,74.92 48.63,86.92 47.81,87.73 35.97,87.73 35.96,90.19 35.16,90.16 23.31,90.21 23.31,85.93 22.16,84.07 H1.8
BATTERY_THRMSTOR_-V  (via drill 0.5, 0.61)
  Top 0.406: J2.X9 89.78,42.88 89.78,68.04 89.82,68.19 89.82,69 89.07,69.89 v85.78,69.89 | v76.61,84.88 76.61,90.16 23.99,90.16 23.31,89.4 23.31,85.33 24.39,84.07 H1.10
  Bottom 0.406: v85.78,69.89 85.74,69.86 79.33,69.86 79.28,69.91 76.61,69.91 v76.61,84.88
BOTTOM_TEMP_SOLAR_PANEL-1  (via drill 0.5, 0.61)
  Top 0.305: 47.18,40.52 48.59,40.52 48.59,40.51 ADC_TEMP_1.9
  Top 0.406: H2.9 25.81,84.99 25.81,74.9 25.94,74.98 25.94,58.8 26.02,58.67 26.42,58.26 26.42,56.03 v25.61,55.21 | R5.1 C4.2 58.24,24.28 v60.16,24.28 | v60.21,28.72 60.22,34.79 58.59,36.34 47.67,36.34 46.81,37.2 46.81,39.94 46.82,39.95 46.82,40.1 47.18,40.52 | v20.33,46.68 20.12,46.48 20.12,37.74 v22.16,35.71 | v24.19,33.67 24.19,31.85 23.99,31.64 23.99,29.2 v23.58,28.8
  Bottom 0.406: v60.16,24.28 60.21,24.38 60.21,25.34 | 60.21,25.34 v60.21,28.72 | v25.61,55.21 26.42,54.4 26.42,53.18 20.12,46.88 v20.33,46.68 | v24.19,33.67 v22.16,35.71 | v23.58,28.8 29.67,22.7 29.88,22.7 30.49,23.31 34.75,23.31 36.72,20.99 55.82,20.99 59.95,25.34 60.21,25.34
BOTTOM_TEMP_SOLAR_PANEL-2  (via drill 0.5, 0.61)
  Top 0.305: 62.54,40.51 ADC_TEMP_1.12
  Top 0.406: H2.11 28.4,84.7 28.41,78.28 27.99,77.83 27.99,60.24 28.25,59.98 v28.25,59.28 28.12,59.28 28.41,59.25 | R6.1 C3.2 61.93,24.34 v63.77,24.34 | v62.89,40.86 62.54,40.51 | v65.23,38.15 70.72,32.66 70.72,29.2 v70.52,29 | v67.88,19.86 68.33,19.25 68.33,9.49 v63.2,4.21
  Bottom 0.406: v63.77,24.34 63.77,30.65 | 63.77,30.65 63.84,30.65 | 63.77,30.65 63.77,38.15 | 63.77,38.15 63.77,39.56 v62.89,40.86 | v65.23,38.15 63.77,38.15 | v70.52,29 73.77,25.75 v67.88,19.86 | v63.2,4.21 62.84,4.26 16.95,4.03 15.82,5.97 15.82,6.17 15.86,13.96 15.86,17.22 13.01,20.06 8.81,20.08 7.42,23.71 7.42,39.15 10.45,44.62 16.87,44.65 25.51,53.28 25.21,53.58 25.21,54.2 24.2,55.21 24.19,55.21 v28.25,59.28
BOTTOM_TEMP_SOLAR_PANEL-3  (via drill 0.5)
  Top 0.305: ADC_TEMP_1.10 47.65,39.86
  Top 0.406: C2.2 65.63,26.06 65.63,24.45 | 65.63,24.45 R7.1 | 65.63,24.45 v67.62,24.45 | 47.65,39.86 47.46,39.67 47.46,37.51 47.91,37.06 65.32,37.06 67.62,34.76 67.61,29.7 67.61,28.88 v67.58,28.84 | v14.43,52.98 15.86,51.56 15.86,47.29 12.68,44.45 3.19,44.45 1.19,42.63 1.19,22.38 3.33,19.9 15,19.96 18.5,23.46 18.75,23.62 20.27,25.14 20.33,25.14 v20.33,26.16
  Bottom 0.406: v67.58,28.84 v67.62,24.45 67.47,24.33 63.77,20.11 30.65,20.11 25.41,25.95 20.53,25.95 v20.33,26.16 | v14.43,52.98 14.43,63.14 20.53,69.23 25.85,69.19 25.85,84.47 26.43,85.17 28.26,85.17 29.47,86.3 H2.13
BOTTOM_TEMP_SOLAR_PANEL-4  (via drill 0.5, 0.61)
  Top 0.305: 56.5,39.84 54.51,39.84 ADC_TEMP_1.11
  Top 0.406: C1.2 69.33,24.38 | 69.33,24.38 R8.1 | 69.33,24.38 71.47,24.38 71.47,30.21 71.4,30.21 71.4,37.5 69.06,39.84 56.5,39.84 v56.5,38.15 | v33.4,39.72 33.69,39.42 33.7,38.68 38.6,33.9 38.65,29.93 v39.1,29.12 | v53.86,31.24 53.65,31.44 v53.65,35.3
  Bottom 0.406: H2.15 33.26,85.18 37.91,85.23 38.42,84.44 38.47,84.39 38.47,79.99 39.01,79.45 39.01,58.21 37.58,56.78 32.45,56.78 32.46,53.56 35.33,50.78 35.33,46.1 34.84,45.61 31.67,45.61 30.84,44.28 30.84,40.97 31.36,39.77 v33.4,39.72 | v39.1,29.12 40.07,27.43 40.07,25.4 40.04,24.33 42.48,21.89 47.96,21.89 52.03,25.95 52.03,27.78 51.21,28.59 v53.86,31.24 | v56.5,38.15 v53.65,35.3
ELEC_BAY_TEMP_0  (via drill 0.5, 0.6)
  Top 0.305: ADC_TEMP_2.11 40.16,39.99 40.16,30.38 v41.52,29.02
  Top 0.406: R15.1 39.52,25.94 C12.2 39.51,24.29 v41.53,24.29 | ADC_TEMP_2.11
  Bottom 0.406: v41.53,24.29 v41.52,24.3 v41.52,29.02 43.45,29.01 43.39,40.54 41.6,43.4 R10.1
ELEC_BAY_TEMP_1  (via drill 0.5, 0.61)
  Top 0.305: ADC_TEMP_2.10 28.59,39.99 28.42,39.82 28.42,37.02 30.86,34.58 36.36,34.58
  Top 0.406: R14.1 C13.2 35.83,24.34 v37.65,24.34 | v37.73,28.67 37.68,31.63 37.68,33.27 36.36,34.58 36.36,34.1 v36.05,33.79 | v38.91,36.57 38.91,37.13 v37.51,38.33 | v33.35,55.09 32.57,55.61 v32.57,59.19 | v28.3,87.66 28.29,86.08 28.98,85.16 30.06,85.16 30.89,84.41 30.91,80.17 32.57,78.31 32.56,73.69 v32.52,73.5 | v35.06,72.14 v35.07,68.95
  Bottom 0.406: v37.73,28.67 37.65,28.59 v37.65,24.34 | v36.05,33.79 36.12,33.79 v38.91,36.57 | v37.51,38.33 37.82,38.68 38.31,39.24 38.42,40.28 38.45,40.31 39.12,40.31 40,41.19 40,42.21 40.02,42.22 40.02,42.44 36.89,45.57 36.87,45.57 36.38,46.06 36.38,51.83 34.2,54.02 34.16,54.02 v33.35,55.09 | v32.57,59.19 36.71,59.19 38.01,60.46 38.01,66.94 | 38.01,66.94 37.67,66.96 | v28.3,87.66 26.62,87.66 25.85,86.92 25.85,86.04 25,85.18 23.92,85.18 23.26,84.22 23.26,83.21 22.36,82.65 21.55,82.65 20.73,83.46 20.73,89.35 20.77,91.42 72.96,91.38 75.19,89.15 H2.50 | v35.06,72.14 v32.52,73.5 | v35.07,68.95 37.6,67 38.01,66.94
EXTERNAL_POWER_+V
  Top 1.27: J3.X3 81.55,67.99 84.06,70.49 84.06,80.37 79.91,84.52 79.91,86.92 H2.52
EXTERNAL_POWER_GND
  Bottom 1.27: H2.51 79.82,84.83 83.55,79.75 83.55,74.48 81.8,71.99 J3.X4
GND  (via drill 0.5, 0.6, 0.61)
  Top 0.305: 54.48,42.44 57.87,42.44
  Top 0.406: H1.52 H1.49 H1.48 H1.45 H1.44 | H1.44 H1.41 | C16.1 C13.1 C12.1 39.51,27.75 C8.1 C7.1 C6.1 C5.1 C4.1 C3.1 C2.1 C1.1 | C16.1 | C16.1 28.48,27.64 C18.1 27.32,27.63 26.68,26.98 26.68,25.73 25.8,24.85 v23.12,24.85 | C15.2 23.21,20.98 | 23.21,20.98 C9.2 | C10.2 6.23,34.11 6.21,33.18 6.19,32.96 6.19,26.84 7.21,26.43 C19.1 11.89,26.37 v11.94,26.42 | 23.21,20.98 23.12,20.89 v23.17,20.84 23.21,20.8 23.21,18.03 | U$6.15 35.31,15.27 | 57.87,42.44 58.88,43.36 76.85,43.36 77.65,44.24 79.26,44.24 | 79.26,44.24 J4.40 J4.39 81.69,44.44 82.71,43.43 82.72,37.43 81.69,36.52 J4.27 J4.28 80.27,36.72 79.16,36.18 79.27,25.16 80.1,25.18 J4.10 80.27,25.14 80.27,24.33 J4.8 80.3,23.94 79.31,23.92 79.26,20.87 79.87,20.26 80.2,20.26 J4.2 | J4.47 J4.48 80.27,49.52 79.26,48.51 79.26,44.24 | 35.31,15.27 35.39,15.35 40.91,15.35 41.45,14.82 41.45,13.06 42.26,12.25 R11.2 44.45,12.26 44.45,13.33 U$4.2 49.56,13.31 49.56,12.55 C11.2 60.87,12.55 U$5.- 63.88,9.56 v67.06,12.73 v67.06,12.75 | D1.A 14.56,32.1 v15.6,32.1 15.78,31.92 C14.2 23.17,33.97 R9.2 23.17,38.75 22.97,38.96 20.8,38.93 20.79,41 20.79,45.67 21.75,46.68 v21.75,47.09 | 80.27,20.06 J4.2 | H2.22 39.63,88.95 37.4,86.71 37.4,86.51 H2.19 37.4,86.3 38.47,85.27 38.46,83.25 37.9,82.75 | v59.14,87.73 63,87.73 63.84,87.75 63.87,86.94 63.84,85.15 65.85,85.16 67.27,83.66 H1.44 | v37.49,78.74 36.79,78.58 36.94,60.84 36.83,60.88 v37.01,60.89 | v20.94,78.18 20.95,77.79 20.95,68.65 v20.91,63.21 | v32.56,60.88 v29.18,60.91 | 42.27,81.43 H1.23 42.07,81.43 41.66,81.43 40.44,82.65 38.01,82.65 37.9,82.75 | 37.2,81.56 H1.19 37.21,81.58 37.19,81.83 37.19,82.04 37.9,82.75
  Top 0.406: v23.78,49.12 21.95,50.95 v21.49,50.66 | v42.31,78.16 47.06,78.16 47.4,78.49 H1.27 | v71.13,12.75 73.2,12.75 v74.89,14.44 | v80.49,16.18 80.39,20.07 J4.2 | C17.2 22.63,17.41 23.21,17.99 23.21,18.03 | 23.21,18.03 32.52,18.03 35.16,15.39 35.31,15.27 | ADC_TEMP_1.15 54.47,42.41 54.48,42.44
  Bottom 0.406: H1.15 32.15,79.85 32.99,79.48 36.64,79.48 | 36.64,79.48 37.31,79.74 37.31,81.29 H1.19 | v23.17,20.84 v23.12,24.85 22.84,25.13 16.67,25.13 15.6,26.2 15.6,26.86 | v15.6,32.1 15.6,26.86 | v11.94,26.42 15.16,26.42 15.6,26.86 | J4.10 80.47,25.14 81.49,25.14 J4.9 | J4.2 80.47,20.06 81.49,20.06 J4.1 | J4.8 80.47,23.92 81.49,23.92 J4.7 | v67.06,12.75 v71.13,12.75 | H1.41 65.03,81.43 64.83,81.43 63.61,82.65 61.37,82.65 60.15,81.43 H1.37 59.95,81.43 59.34,81.43 58.12,82.65 56.29,82.65 55.07,83.87 H1.34 | H2.19 37.19,86.51 34.75,86.51 H2.17 34.75,86.71 34.55,86.71 32.32,88.95 H2.16 | H2.22 39.83,88.95 39.83,90.18 44.84,90.18 | v59.14,87.73 58.95,87.72 58.14,87.72 57.91,87.72 56.61,87.73 56.23,88.4 56.26,90.18 55.01,90.18 44.84,90.18 | v37.49,78.74 36.79,78.99 36.64,79.48 | v20.94,78.18 18.17,80.89 18.16,86.91 18.5,87.32 16.87,88.95 H2.4 | v29.18,60.91 28.35,60.8 | 28.35,60.8 v20.91,63.21 | v32.56,60.88 35.14,60.89 v37.01,60.89 | v23.78,49.12 v21.75,47.09 | v21.49,50.66 21.49,53.56 23.17,55.21 27.24,59.28 27.24,59.68 28.35,60.8 | H1.23 v42.31,78.16 | v74.89,14.44 78.43,14.44 v80.49,16.18 | H2.26 44.84,90.18
  pour GND: -0.24,92.22 90.07,92.09 90.07,-0.2 -0.33,-0.2 -0.42,92.07 -0.37,92.2
MAX_Q6_RS232  (via drill 0.5)
  Top 0.406: v73.4,55.67 73.28,55.79 v59.16,55.79 | v45.72,61.23 40.88,61.23 39.78,62.33 39.78,65.85 40.32,66.65 41.44,66.63 42.63,67.82 42.65,75.54 42.6,75.59 40.99,75.59 39.67,76.91 39.67,81.41 | 39.78,81.52 39.67,81.41 | H1.21 39.83,81.43 39.67,81.41
  Bottom 0.406: J4.44 79.09,46.79 78.15,47.72 78.04,50.93 77.75,51.21 74.33,51.21 73.4,52.15 v73.4,55.67 | v59.16,55.79 58.9,56.05 58.9,59.63 58.4,60.13 56.8,60.13 56.54,60.39 52.95,60.39 52.1,61.23 v45.72,61.23
MECH_DEPLOY_SWITCH_+V  (via drill 0.5)
  Top 0.406: H2.31 53.67,85.24 53.67,76.91 | 53.67,76.91 53.66,76.44 | v53.52,63.15 53.71,76.74 53.67,76.91
  Bottom 0.406: J2.X4 85.34,61.93 54.46,61.97 54.13,62.17 v53.52,63.15
MECH_DEPLOY_SWITCH_-V  (via drill 0.5)
  Top 0.406: H2.33 56.31,85.13 56.31,65.81 v57.7,64.42 | J2.X5 84.93,58.24 54.61,58.24 52.5,60.38 v52.5,63.93
  Bottom 0.406: v52.5,63.93 52.51,64.66 53.1,65.3 54.57,65.3 56.13,63.74 57.02,63.74 v57.7,64.42
N$3  (via drill 0.5)
  Top 0.305: ADC_TEMP_2.15 36.84,42.59 v37.21,42.07
  Top 0.406: R16.2 25.19,29.36 26.53,30.7 v26.53,38.73
  Bottom 0.406: v37.21,42.07 37.21,39.9 36.26,38.74 27.85,38.74 v26.53,38.73
N$10  (via drill 3.2)
  other vias: 9.08,88.82
N$12  (via drill 3.2)
  other vias: 82.74,88.82
N$14  (via drill 3.2)
  other vias: 85.25,3.12
N$16  (via drill 3.2)
  other vias: 5.29,3.12
POW_3V3
  Bottom 0.406: H1.16 33.36,82.69 36.11,82.69 37.23,83.82 H1.20
POW_5V  (via drill 0.5)
  Top 0.406: H1.28 48.71,82.59 48.71,72.81 | v76.92,55.07 76.89,55.06 | 57.92,57.04 v57.72,57.25 | 48.29,59.89 48.37,59.89 48.29,59.57
  Top 0.813: H1.26 H1.28 | 48.71,72.81 48.28,72.15 48.29,59.89 48.29,59.54 | 76.89,55.06 74.27,57.04 70.11,57.04 57.92,57.04 | 48.29,59.57 48.29,58.67 v48.31,58.66 | J4.49 J4.50 83.18,50.6 v84.05,49.73
  Bottom 0.813: v48.31,58.66 51.38,58.66 56.29,58.67 v57.72,57.25 | v84.05,49.73 84.05,52.66 82.95,53.72 78.22,53.72 v76.92,55.07
POW_9V
  Top 0.406: H1.22 39.83,83.87 42.27,83.87 H1.24
POW_BATT_GND
  Top 1.27: H1.33 55.01,61.69 55.84,59.74 80.7,59.71 J3.X1
POW_BATT_VOUT
  Top 1.27: H1.35 57.61,81.31 57.61,67.34 60.68,64.45 61.23,64.41 77.66,64.41 78.08,63.99 J3.X2
POW_RADIO_GND
  Top 0.406: H2.29 49.99,86.51 49.99,88.95 H2.30 50.2,88.95 52.43,88.95 H2.32
POW_RADIO_VBATT
  Top 0.406: H2.46 H2.45
PWR_CTRL  (via drill 0.5)
  Top 0.406: R11.1 43.56,14.27 U$4.1 45.71,15.4 v45.72,16.87 | v86.37,38.15 85.35,39.16 85.35,44.65 82.1,47.9 81.9,47.9 81.69,48.1 J4.45 | v78.85,4.21 75.67,4.21 v75.66,7.02
  Bottom 0.406: v45.72,16.87 70.89,16.99 72.97,13.34 74.91,11.8 74.91,7.77 v75.66,7.02 | v86.37,38.15 86.77,37.74 87.79,37.74 89.21,36.32 89.34,13.57 89.33,13.53 89.33,7.33 88.24,6.39 83.94,6.39 81.76,4.21 v78.85,4.21
Q6_AIN_0  (via drill 0.5, 0.6)
  Top 0.406: v75.44,23.08 75.44,37.14 v76.04,37.74 | H1.39 62.63,72.35 v62.76,72.22 | v65.71,72.31 65.71,67.16 v65.76,67.11 | v65.79,62.92 v65.8,61.06 | v65.73,51.43 72.23,51.43 v72.26,51.37
  Bottom 0.406: J4.3 82.38,21.39 82.92,20.84 82.92,19.24 81.96,18.28 79.62,18.28 78.17,19.73 78.17,19.8 v75.44,23.08 | v76.04,37.74 76.19,44.93 75.96,45.29 75.97,45.43 75.91,48.61 75.29,49.13 75.26,49.13 72.9,51.49 v72.26,51.37 | v62.76,72.22 65.62,72.22 v65.71,72.31 | v65.76,67.11 65.76,62.76 v65.79,62.92 | v65.8,61.06 65.8,51.62 v65.73,51.43
Q6_AIN_1  (via drill 0.5)
  Top 0.406: H1.43 67.76,81.32 67.76,68.94 67.75,68.94 v67.75,67.03 | v67.73,62.89 v67.74,61.06
  Bottom 0.406: v67.75,67.03 67.73,67.01 v67.73,62.89 | v67.74,61.06 67.75,60.93 67.75,52.49 66.07,50 66.08,48.03 66.11,44.5 67.06,43.3 67.06,35.69 74.56,26.28 74.44,22.56 77.54,19.01 77.66,18.85 79.19,17.32 82.4,17.32 83.8,18.72 83.8,21.23 82.38,22.66 J4.5
Q6_AOUT_0  (via drill 0.5)
  Top 0.406: H1.47 71.16,79.73 71.16,68.64 71.15,68.63 v71.15,67.19 | v71.15,62.86 v71.15,61.05
  Bottom 0.406: v71.15,67.19 v71.15,62.86 | v71.15,61.05 71.15,54.13 67.23,48.32 67.23,47.41 67.23,45.44 67.58,44.92 67.68,44.72 68.27,43.39 68.11,35.73 75.5,26.63 75.48,24.88 75.88,24.47 75.88,24.44 78.94,21.39 J4.4
Q6_AOUT_1  (via drill 0.5)
  Top 0.406: H1.51 74.16,77.65 74.16,69.89 74.23,69.82 v74.23,67.19 | v74.19,62.89 v74.17,61.04
  Bottom 0.406: v74.23,67.19 74.19,67.15 v74.19,62.89 | 74.15,61.24 v74.17,61.04 72,59.77 72.02,54.32 71.84,53.73 68.04,47.59 68.03,46.56 68.53,45.38 68.64,45.24 69.23,44.06 69.06,35.92 76.59,26.83 76.46,25.12 78.93,22.66 J4.6
Q6_GPIO_0  (via drill 0.5, 0.61)
  Top 0.406: v78.95,8.55 78.69,8.97 78.7,14.79 77.08,16.64 74.58,16.61 73.16,15.18 71.13,15.18 70.91,15.17 69.23,15.19 69.26,14.76 69.25,9.07 64.8,4.48 v64.8,4.18 | v72.43,3.77 72.44,3.68 72.35,3 71.38,2.14 46.23,2.16 | 46.23,2.16 43.51,2.17 v43.43,2.15 | v20.94,2.59 20.73,2.79 20.73,8.07 v20.94,8.27 | v21.82,43.65 21.83,44.6 21.83,45.35 v23.17,47.09 | U$4.4 47.98,12.37 47.98,10.69 46.3,10.69 v46.3,10.62 | v46.28,8.3 46.23,8.3 46.23,2.16
  Bottom 0.406: v78.95,8.55 80.45,8.87 81.67,8.87 82.91,8.88 85.84,8.86 86.65,9.24 86.66,14.35 86.63,14.82 86.59,25.09 86.59,25.3 85.41,26.47 J4.11 | v64.8,4.18 64.88,4.13 72.38,4.17 v72.43,3.77 | v43.43,2.15 40.52,2.59 22.03,2.59 v20.94,2.59 | v20.94,8.27 20.73,8.07 19.51,8.07 19.31,8.27 19.31,21.48 17.08,23.72 16.82,24.24 14,24.24 13.04,22.5 10.72,22.5 9.99,24.4 9.99,37.81 12.21,42.05 18.91,42.01 20.88,43.64 v21.82,43.65 | v23.17,47.09 22.97,47.29 23.78,48.1 24.19,48.1 25.81,49.73 25.81,49.93 30.13,54.63 | 30.12,54.76 30.13,54.63 | 30.13,54.63 30.13,59.56 30.12,59.57 30.12,67.52 29.15,68.49 29.15,68.87 29.33,69.05 29.33,81.29 29.47,81.43 H1.13 | v46.3,10.62 46.28,10.62 v46.28,8.3
Q6_GPIO_2  (via drill 0.5, 0.61)
  Top 0.305: 26.22,42.99 24.58,41.55
  Top 0.406: H2.24 43.64,87.63 43.64,79.17 43.58,79.1 41.01,79.12 v40.97,77.26 | v84.54,28.66 86.74,26.29 86.74,10.84 86.13,10.16 80.85,10.16 v80.74,10.42 | v41.27,0.97 41.53,1.11 71.39,1.12 73.36,2.67 73.36,3.19 74.53,3.24 74.53,7.66 v76.8,10.51 | v18.9,1.48 18.61,1.51 18.09,2.39 18.09,19.55 17.83,19.8 v17.33,19.81 | v15.6,38.9 15.6,38.98 14.94,39.88 13.85,39.92 4.91,39.92 4.01,39.29 3.87,23.88 5.74,22.01 12.83,22.01 13.86,23.04 15.14,23.04 v15.5,21.92 | 24.58,41.55 v24.59,41.6 | v26.32,43 26.22,42.99 | v33.72,47.1 34.05,46.48 40.04,46.48 v40.28,46.76 | v37.77,71.84 38.14,71.82 39.57,71.82 v41.07,71.81 | v36.18,55.21 34.16,57.22 34.16,78.01 v34.48,78.29
  Bottom 0.406: v84.54,28.66 84.21,29.03 82.17,29.03 81.69,29 J4.15 | v76.8,10.51 v80.74,10.42 | v18.9,1.48 20.94,1.57 21.14,1.57 21.85,1.53 38.72,1.59 40.43,1.59 v41.27,0.97 | v15.6,38.9 16.25,38.72 17.71,38.75 18.53,39.56 18.87,39.57 21.92,39.57 v24.59,41.6 | v33.72,47.1 32.09,47.12 31.35,46.34 29.67,44.44 29.68,43.08 29.25,43.07 v26.32,43 | v40.28,46.76 40.3,47.29 40.32,50.13 39.35,50.14 37.82,50.22 37.82,52.81 35.77,54.81 v36.18,55.21 | v34.48,78.29 34.9,78.38 36.18,78.38 37.64,76.78 37.64,71.72 v37.77,71.84 | v41.07,71.81 41.02,71.79 40.98,77.22 v40.96,77.25 v40.97,77.26 | v17.33,19.81 15.75,21.58 v15.5,21.92
Q6_GPIO_6  (via drill 0.5)
  Top 0.406: H1.7 22.01,81.35 22.01,59.07 v21.95,59.07 | v84.82,32.55 v83.12,33.88 | v15.65,45.66 15.65,45.4 13.3,43.53 3.52,43.53 2.14,42.27 2.1,23.05 3.99,20.76 14.25,20.74 v14.5,21.09
  Bottom 0.406: J4.23 82.57,34.09 82.64,34.15 82.91,33.88 v83.12,33.88 | v84.82,32.55 84.86,31.16 84.92,30.86 86.17,29.61 88.2,28.97 88.42,28.47 88.55,14 88.52,13.94 88.52,8.39 87.36,7.16 83.51,7.16 82.99,6.65 78.24,6.65 77.63,6.04 36.99,6.04 24.14,6.2 18.25,6.2 18.25,6.29 17.33,6.82 17.28,18.14 v14.5,21.09 | v15.65,45.66 19.51,49.52 19.51,54.6 19.92,55.01 19.92,57.45 19.72,57.65 19.72,58.67 20.12,59.07 v21.95,59.07
Q6_GPIO_7  (via drill 0.5)
  Top 0.406: H1.9 24.56,81.34 24.56,67.61 24.54,67.75 v24.53,66.2 | v56.11,57.11 58.48,54.73 72.91,54.73 72.99,54.65 74.17,54.65 v74.58,55.07 | v53.56,57 53.56,57.04 v50.53,60.07 | v45.67,60.04 38.99,60.04 v37.04,58.1 | v35.1,58.05 35.1,62.16 v35.11,62.25 | v32.57,62.23 v29.12,62.23
  Bottom 0.406: J4.25 82.44,35.36 82.94,35.86 82.94,51.5 82.01,52.43 77.08,52.43 77.08,52.57 v74.58,55.07 | v56.11,57.11 53.67,57.11 v53.56,57 | v50.53,60.07 46.15,60.07 v45.67,60.04 | v37.04,58.1 34.93,58.1 v35.1,58.05 | v35.11,62.25 32.68,62.28 v32.57,62.23 | v29.12,62.23 28.31,62.92 v24.53,66.2
Q6_GPIO_8  (via drill 0.5, 0.6)
  Top 0.406: H1.11 27.11,81.33 27.11,58.94 27.22,58.82 v27.22,55.45 | v69.21,46.16 69.06,46.11 66.17,46.11 65.34,47.01 55.19,47.01 55.16,46.99 44.55,46.99 42.95,50.05 27.18,50.16 v24.84,50.15
  Bottom 0.406: J4.12 78.03,26.47 70.17,36.06 70.15,44.58 v69.21,46.16 | v27.22,55.45 27.12,55.35 27.14,55.33 27.14,54.12 27.11,54.09 27.12,52.47 24.95,50.22 v24.84,50.15
Q6_GPIO_10  (via drill 0.5, 0.6)
  Top 0.406: H1.32 51.16,82.59 51.16,80.36 50.75,79.95 50.75,73.91 50.76,73.9 49.51,71.4 49.51,57.04 49.52,56.79 49.6,56.59 v49.6,55.2 | v71.98,45.64 69.9,45.27 58.72,45.27 v58.25,45.74
  Bottom 0.406: J4.16 78.59,29.01 72.17,36.24 72.17,43.82 v71.98,45.64 | v58.25,45.74 58.27,45.92 56.42,47.91 50.25,47.91 49.58,48.58 49.6,55.23 v49.6,55.2
Q6_GPIO_13  (via drill 0.5, 0.6)
  Top 0.406: H1.36 58.86,82.6 58.86,70.19 58.85,70.19 58.85,68.08 59.5,67.44 v59.87,67.44 | v60.24,62.96 v60.24,61.07 | v75.03,46.6 75,47.53 75,48.8 74.72,49.09 61.2,49.09 v60.17,50.12
  Bottom 0.406: v59.87,67.44 60.24,67.07 v60.24,62.96 | v60.24,61.07 60.26,61.02 60.26,56.18 60.17,56.09 v60.17,50.12 | J4.22 79.01,32.82 75.05,37.32 75.1,45.68 v75.03,46.6
Q6_GPIO_14  (via drill 0.5, 0.6)
  Top 0.406: H1.38 61.41,82.59 61.41,67.49 61.9,67 v61.9,65.88 | v61.88,63.01 61.86,62.99 v61.87,61.07 | v76.87,45.91 76.83,46.71 76.85,47.32 76.79,49.53 76.48,49.84 62.87,49.84 v61.91,50.8
  Bottom 0.406: v61.9,65.88 61.88,65.86 v61.88,63.01 | 61.88,61.13 v61.87,61.07 61.88,56.18 61.91,56.15 v61.91,50.8 | J4.24 79.14,34.11 77.05,37.22 77.06,45.58 v76.87,45.91
Q6_GPIO_15  (via drill 0.5, 0.6)
  Top 0.406: H1.40 63.96,82.58 63.96,68.59 63.95,68.59 v63.95,67.05 | v63.95,62.85 v63.95,61.06 | v78.11,45.94 78.14,46.86 78.11,47.5 78.11,50.38 77.93,50.48 65.13,50.48 v64.4,51.29
  Bottom 0.406: v63.95,67.05 v63.95,62.85 | v63.95,61.06 63.97,61.06 63.97,56.03 64.4,55.6 v64.4,51.29 | J4.26 79.29,35.36 78.1,37.35 78.1,45.62 v78.11,45.94
Q6_I2C_SCL_1  (via drill 0.5, 0.6, 0.61)
  Top 0.305: ADC_TEMP_2.19 41.61,45.19 | 55.89,45.06 ADC_TEMP_1.19
  Top 0.406: H2.20 36.01,87.75 36.01,57.08 v38.01,55.08 | U$6.18 31.5,16.02 v30.82,17.04 | 41.61,45.19 41.64,45.19 42.85,45.19 43.07,44.95 v46.36,44.93 | v55.98,45.48 55.89,45.06 | v48.57,48.71 52.61,48.74 v53.47,50.26
  Bottom 0.406: v30.82,17.04 31.49,17.61 32.56,18.68 65.44,18.8 | 65.44,18.8 73.05,18.79 73.16,14.91 73.66,14.02 75.74,12.35 75.74,8.89 78.41,7.51 80.88,7.55 80.97,7.54 82.54,7.54 83.19,8.19 87.02,8.19 87.77,8.94 87.77,14.39 87.77,14.51 87.77,25.19 85.3,27.74 J4.13 | v38.01,55.08 38.01,54.97 43.05,49.93 43.05,49.56 44.81,47.8 44.81,47.72 46.2,46.34 | 46.2,46.34 46.41,46.12 46.41,44.98 v46.36,44.93 46.61,45.04 52.99,45.04 53.66,45.71 55.76,45.71 v55.98,45.48 | v48.57,48.71 46.2,46.34 | v53.47,50.26 56.74,50.32 66.25,40.79 66.25,29.81 68.08,29.81 68.69,29.2 68.69,21.69 68.28,21.69 65.44,18.84 65.44,18.8
Q6_I2C_SDA_1  (via drill 0.5, 0.6)
  Top 0.305: ADC_TEMP_2.18 41,44.54 41.75,43.91 v44.66,43.9 | 57.67,44.41 ADC_TEMP_1.18
  Top 0.406: H2.18 33.41,87.69 33.5,56.38 v34.7,54.97 | U$6.17 32.77,15.1 v32.77,16.34 | 57.67,44.41 v58.07,44.32 58.29,44.27 59.39,44.27 59.72,44.59 v71.1,44.53 | v41.89,40.21 43.12,40.21 v44.21,41.3 | v71.94,17.62 74.05,20.74 v74.05,32.95
  Bottom 0.406: v32.77,16.34 33.25,17.24 33.75,17.82 71.18,17.8 71.48,17.85 v71.94,17.62 | J4.14 78.35,27.74 75.19,31.43 | 75.19,31.43 71.17,36.13 71.16,44.23 71.16,44.41 v71.1,44.53 | v58.07,44.32 57.67,44.41 ADC_TEMP_1.18 54.47,44.4 53.43,44.4 51.87,43.9 v44.66,43.9 44.21,43.35 v44.21,41.3 | v34.7,54.97 37.13,52.54 37.22,46.68 41.03,42.87 41.03,40.89 41.71,40.21 v41.89,40.21 | v74.05,32.95 75.19,31.43
Q6_MAX_RS232  (via drill 0.5, 0.61)
  Top 0.406: v79.05,42.41 78.26,41.62 74.81,41.62 71.86,41.63 71.2,42.6 66.25,42.62 v66.05,42.41 | v47.03,70.28 46.95,61.51 v46.95,58.67
  Bottom 0.406: H1.25 44.85,75.19 | 44.85,75.19 44.81,75.14 | v79.05,42.41 78.85,42.62 78.85,44.24 80.07,45.46 80.27,45.46 J4.42 | v66.05,42.41 64.83,43.63 64.83,43.83 65.44,44.44 60.87,49 59.06,49 51.62,57.25 48.37,57.25 v46.95,58.67 | v47.03,70.28 44.85,75.13 44.85,75.19
Q6_SPI_CS0  (via drill 0.5, 0.61)
  Top 0.406: v74.02,45.01 73.97,47.03 73.04,47.96 66.84,47.96 66.37,48.42 60.14,48.42 58.87,49.69 v58.89,50.71 | v56.09,55.21 56.09,55.82 51.82,60.09 51.82,63.18 51.35,63.65 51.35,64.47 52.57,65.92 52.55,69.98 v52.64,70.25
  Bottom 0.406: J4.20 78.87,31.57 74.07,37.02 74.07,45.11 v74.02,45.01 | v52.64,70.25 52.98,71.15 59.17,71.15 68.97,80.82 68.97,81.67 68.96,82.28 68.97,83.14 68.97,84.56 68.28,85.16 63.86,85.17 63.84,86.1 63.84,87.72 63,87.73 62.19,87.73 61.58,87.12 60.76,87.12 60.15,86.51 H2.37 | v56.09,55.21 58.87,52.03 58.87,51.83 v58.89,50.71
Q6_SPI_CS1  (via drill 0.5)
  Top 0.406: v59.95,73.3 60.36,72.89 v60.36,70.86 | v78.85,67.61 v75.6,70.86
  Bottom 0.406: H2.25 46.18,85.07 46.17,73.91 50.4,73.91 52.47,71.94 58.56,71.94 v59.95,73.3 | J4.21 83.52,32.82 85.17,34.47 85.17,56.28 85.15,56.43 86.49,57.97 87.31,57.97 88.88,58.94 88.83,61.19 87.61,61.99 86.85,61.97 86.21,62.51 84.54,64.03 84.45,65.86 78.85,65.85 v78.85,67.61 | v60.36,70.86 60.56,70.66 65.84,70.66 66.25,70.69 66.99,70.66 67.47,70.66 75.39,70.66 v75.6,70.86
Q6_SPI_SCLK  (via drill 0.5)
  Top 0.406: J4.17 83.38,30.24 88.63,29.18 88.6,23.31 88.58,8.93 86.81,7.15 78.72,7.15 78.66,7.21 78.64,7.16 77.81,8.27 77.8,14.33 76.79,15.8 75.19,15.8 74.83,15.8 73.19,14.06 v70.42,14.07 | v33.26,51.43 33.42,51.46 v48.11,51.49 | v48.08,55 47.98,55.1 45.1,55.1 41.13,59.07 v41.05,59.07
  Bottom 0.406: v70.42,14.07 69.42,14.98 67.67,14.98 67.64,14.95 67.05,14.95 64.77,12.67 64.77,7.35 64.71,7.29 18.71,7.29 18.53,7.47 18.53,21.24 16.7,23.15 14.32,23.15 13.53,21.83 9.86,21.83 9.38,23.27 9.15,23.96 9.15,25.32 9.11,38.14 11.62,42.72 13.91,42.72 13.97,42.78 17.66,42.78 17.75,42.68 18.65,42.68 20.94,44.97 20.94,45.05 22.36,45.05 26.46,45.01 29.99,48.58 32.96,51.36 v33.26,51.43 | v41.05,59.07 39.76,60.83 39.76,78.92 41.05,80.82 41.05,81.83 41.04,82.53 41.05,83.46 41.05,84.47 39.43,86.1 39.63,86.3 H2.21 | v48.11,51.49 48.08,51.46 v48.08,55
Q6_SPI_SDI_MISO  (via drill 0.5)
  Top 0.406: v52.3,74.76 50.45,70.96 50.45,64.27 50.4,64.22 50.4,63.47 v50.42,62.83 | v87.53,27.74 87.53,10.39 86.5,9.36 81.12,9.36 81.07,9.31 79.87,9.31 79.37,10.33 79.38,15.3 77.44,17.39 73.99,17.39 72.61,16.01 69.77,16.01 v69.62,16.08 | v12.74,18.85 12.95,19.05 15.06,19.09 19.29,23.1 v19.75,23 | v45.66,63.34 44.31,64.68 41.57,64.68 v41.53,64.72 | v41.6,70.28 39.73,70.29 v37.75,70.27 | v32.51,68.52 32.24,68.15 v29.08,64.08
  Bottom 0.406: H2.35 56.27,85.16 54.25,85.16 53.67,84.58 53.67,76.79 52.3,75.42 v52.3,74.76 52.43,74.72 | J4.19 82.66,31.55 84.92,29.61 85.06,29.5 85.94,28.61 86.86,28.57 v87.53,27.74 | v69.62,16.08 53.75,16.12 53.72,16.08 47.04,16.08 46.7,15.74 34.34,15.74 33.82,15.22 21.74,15.22 20.94,16.02 20.94,21.44 19.39,22.99 v19.75,23 | v50.42,62.83 50.41,62.8 50.43,62.77 49.94,63.34 v45.66,63.34 | v12.74,18.85 12.68,18.87 8.12,18.91 6.31,23.75 6.31,39.6 9.42,45.03 9.74,45.5 13.95,45.46 16.47,47.98 16.47,61.11 21.7,66.34 23.07,66.34 23.5,66.77 23.69,66.77 24.1,67.18 26.46,67.18 v29.08,64.08 | v41.53,64.72 41.58,64.83 v41.6,70.28 | v37.75,70.27 33.92,70.27 v32.51,68.52
Q6_SPI_SDO_MOSI  (via drill 0.5)
  Top 0.406: v73.07,46.38 71.77,47.04 70.35,47.06 66.53,47.06 65.83,47.74 46.52,47.74 v43.81,50.45
  Bottom 0.406: H2.23 43.61,85.13 43.61,77.78 42.87,76.52 42.82,57.75 43.48,56.49 43.55,56.47 43.81,56.21 v43.81,50.45 | J4.18 78.74,30.28 73.09,36.62 73.1,44.34 v73.07,46.38
REF_IN  (via drill 0.5)
  Top 0.305: ADC_TEMP_1.6 40.45,42.46 | v24.68,37.82 24.68,38.49 26.47,40.28 26.47,40.84 27.62,41.99 27.96,41.99 28.57,42.6 ADC_TEMP_2.6 31.78,42.59 v32.49,41.88
  Top 0.406: R17.1 13.04,27.64 | 13.04,27.64 7.91,27.64 C19.2 | 13.04,27.64 13.26,27.87 D1.C 13.3,34.57 v13.31,35.93 | 40.45,42.46 v38.61,42.04
  Bottom 0.406: v38.61,42.04 38.63,42.65 36.77,44.51 32.73,44.53 32.47,44.27 32.47,42.43 v32.49,41.88 | v13.31,35.93 18.18,35.89 19.13,36.84 24.25,36.84 24.28,36.81 24.28,37.42 v24.68,37.82
SOLAR_PANEL_GND  (1 unrouted)
THERMALGND1  (via drill 0.5)
  Top 0.305: ADC_TEMP_2.3 ADC_TEMP_2.4 27.46,43.89 | ADC_TEMP_1.4 ADC_TEMP_1.3 | 32.5,45.84 ADC_TEMP_2.20 48.52,45.84 ADC_TEMP_1.1 49.75,45.71 | 32.5,45.84 ADC_TEMP_2.1 28.32,45.84 27.55,45.07 27.55,43.98 | 49.75,45.71 ADC_TEMP_1.20 | ADC_TEMP_1.3 49.75,44.41 49.75,45.71 | 32.7,48.1 32.65,45.83 | 32.54,45.8 32.5,45.84
  Top 0.406: H1.5 19.46,72.79 19.48,72.77 19.48,59.79 20.63,58.63 v20.63,58.11 | R9.1 23.18,42.41 24.66,43.89 27.46,43.89 27.55,43.98 | ADC_TEMP_1.3 | 32.65,45.83 32.54,45.8 | v20.46,49.54 20.5,48.11 32.7,48.1 38.88,48.1 R10.2
  Bottom 0.406: 20.65,58.19 v20.63,58.11 20.88,57.87 20.88,54.55 20.46,54.13 v20.46,49.54
TOP_TEMP_SOLAR_PANEL-1  (via drill 0.5, 0.6)
  Top 0.305: 46.27,41.82 ADC_TEMP_1.7 | 48.78,41.8 ADC_TEMP_1.7 | ADC_TEMP_1.7
  Top 0.406: H2.1 12.79,86.43 11.21,84.79 11.21,59.07 18.08,52.19 18.08,34.6 v18.25,34.44 | R1.1 43.44,22.73 43.44,25.26 43.49,25.26 C8.2 43.49,24.47 v45.36,24.47 | v45.36,28.69 45.36,31.27 | 45.36,31.27 45.36,40.91 46.27,41.82 | v32.8,31.21 35.39,31.21 v35.41,31.24 | v42.34,31.35 45.28,31.35 45.36,31.27
  Bottom 0.406: v45.36,24.47 v45.36,28.69 | v18.25,34.44 18.25,34.34 21.19,31.4 32.62,31.4 v32.8,31.21 | v35.41,31.24 42.23,31.24 v42.34,31.35
TOP_TEMP_SOLAR_PANEL-2  (via drill 0.5)
  Top 0.305: 58.56,41.81 ADC_TEMP_1.14
  Top 0.406: H2.3 16.9,86.6 15.86,87.64 12.76,87.64 10.11,84.99 10.11,58.67 13.46,55.32 13.46,55.27 15.88,52.85 15.92,52.85 16.7,52.07 16.71,50.95 v16.71,33.5 | R2.1 47.17,22.73 C7.2 47.17,24.47 v49.19,24.47 | v59.05,42.3 58.56,41.81 | v32.87,30.02 32.9,30 v35.26,30 | v42.4,30.01 42.39,30.03 v44.38,30.02
  Bottom 0.406: v49.19,24.47 49.19,30.03 | 49.19,30.03 49.19,30.77 49.19,33.2 50.3,34.18 56.8,34.18 58.23,35.6 58.88,35.6 59.69,36.41 59.69,41.04 v59.05,42.3 | v16.71,33.5 20.19,30.02 v32.87,30.02 | v35.26,30 v35.27,29.99 v42.4,30.01 | v44.38,30.02 44.89,30.03 49.19,30.03
TOP_TEMP_SOLAR_PANEL-3  (via drill 0.5, 0.6)
  Top 0.305: 46.74,41.16 ADC_TEMP_1.8 | ADC_TEMP_1.8
  Top 0.406: H2.5 | H2.5 18.21,85.19 13.26,85.19 12.11,84.04 12.11,59.84 19.37,52.58 19.37,35.46 v19.4,35.43 | R3.1 C6.2 50.86,24.34 v52.84,24.34 | v52.83,28.67 52.83,30.67 | 52.83,30.67 52.84,34.11 51.74,35.22 47.79,35.22 46.06,36.95 46.06,40.48 46.74,41.16 | v32.81,32.72 32.88,32.66 v35.4,32.66 | v42.53,32.72 42.62,32.63 v44.34,32.63 | v46.86,31.17 47.36,30.67 52.83,30.67
  Bottom 0.406: v52.84,24.34 v52.83,28.67 | v19.4,35.43 22.11,32.72 v32.81,32.72 | v35.4,32.66 35.46,32.72 v42.53,32.72 | v44.34,32.63 v44.35,32.63 46.66,32.63 46.86,32.43 v46.86,31.17
TOP_TEMP_SOLAR_PANEL-4  (via drill 0.5, 0.6)
  Top 0.305: 60.49,41.16 ADC_TEMP_1.13 | 54.46,41.14 52.81,41.14 51.24,39.57
  Top 0.406: R4.1 C5.2 54.54,24.38 v56.54,24.38 | v60.92,41.59 60.49,41.16 | ADC_TEMP_1.13 54.46,41.14 | 51.24,39.57 51.24,38.42 51.04,38.22 v48.69,38.22 | v44.38,38.22 44.34,38.19 v42.47,38.19 | v35.01,35.54 34.98,35.51 v31.72,35.51 | v23.06,43.71 23.04,44.01 23.04,44.82 25.37,47.09 v25.41,47.09 | v30.58,68.87 29.25,67.17 v29.07,66.92 | v23.37,67.96 23.23,68.1 23.23,82.56 21.58,82.56 20.73,83.31 20.73,85.14 21.98,86.3 H2.7
  Bottom 0.406: v56.54,24.38 56.54,30.81 56.28,30.81 56.28,32.52 58.08,34.32 60.83,34.32 61.49,34.98 61.49,40.48 v60.92,41.59 | v48.69,38.22 v44.38,38.22 | v42.47,38.19 42.59,38.19 38.97,38.19 36.32,35.54 v35.01,35.54 | v31.72,35.51 31.68,35.47 27.91,35.47 25.59,37.79 25.59,42.49 24.35,43.73 v23.06,43.71 | v25.41,47.09 30.51,52.18 30.51,52.77 30.88,53.14 30.88,66.65 30.87,66.67 30.87,68.53 30.64,68.76 v30.58,68.87 | v29.07,66.92 28.03,67.96 v23.37,67.96
VBAT
  Top 0.406: U$5.+$1 72.04,9.5 71.25,3.64 70.7,2.99 56.8,2.99 55.68,3.67 U$5.+$2 35.54,9.54 34.1,10.99 34.1,12.99 U$6.16
(copper drawn outside any net)
  shapes: Bottom area x1